# Altium project SKC_KONTROLER.PrjPcb (part 1 of 2)
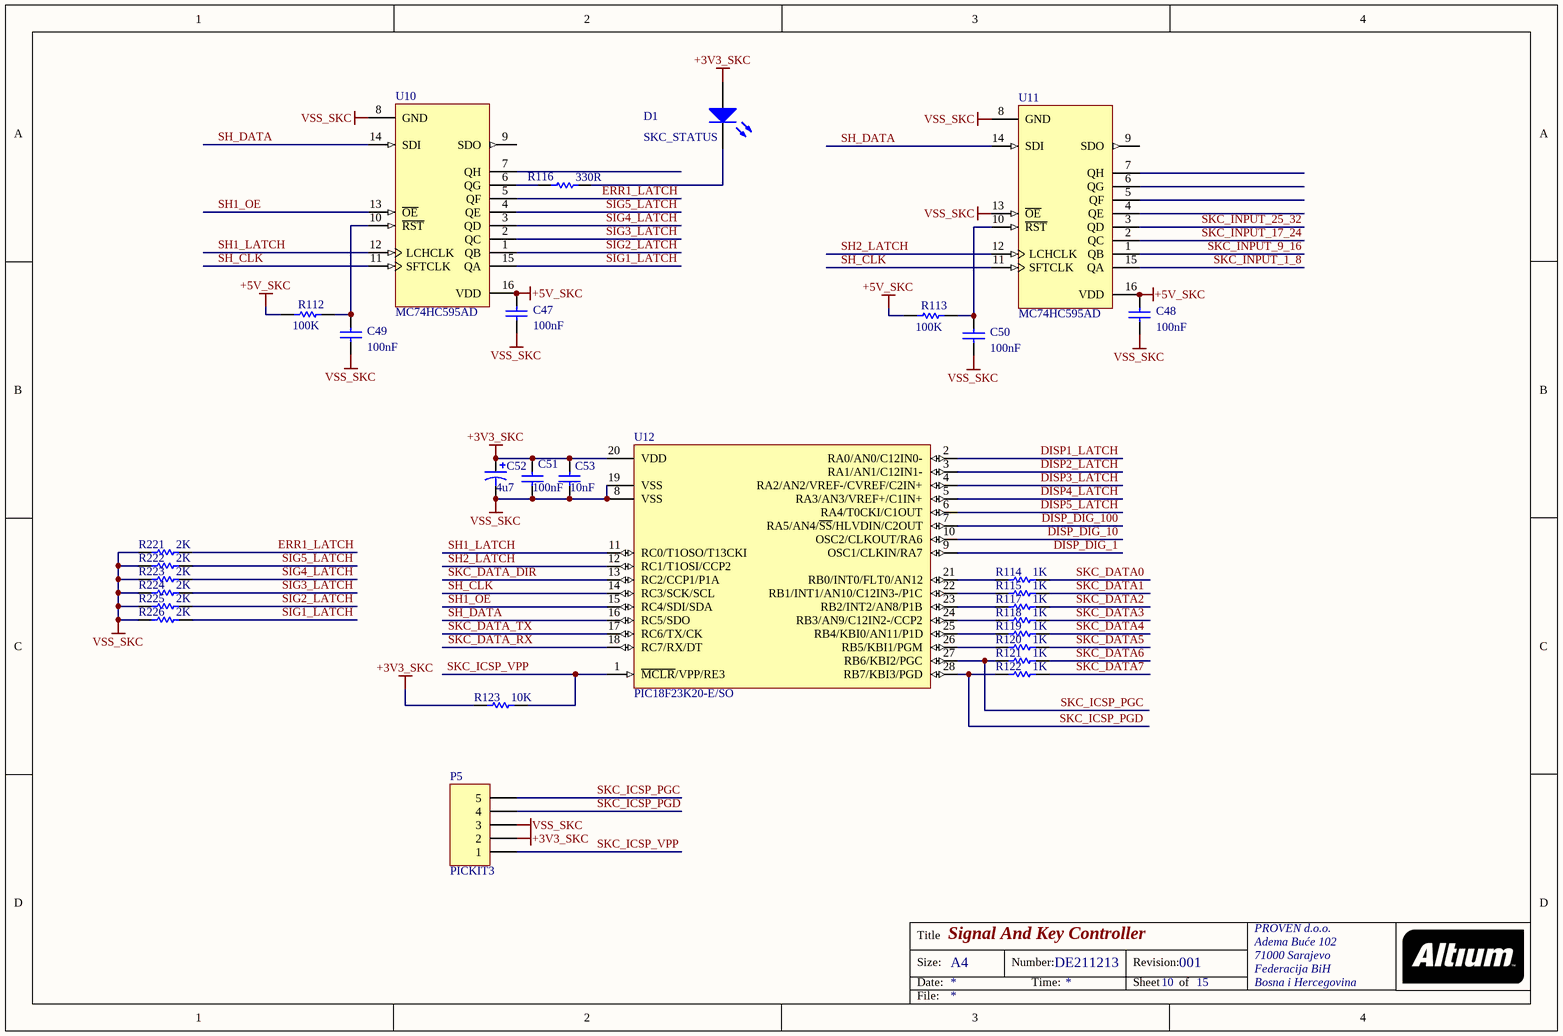
[diagram p0: SignalAndKeyController.SchDoc]
7 sheets, 399 parts. Net scope: global (net labels, ports and power ports of the same name join across sheets).
Board file: SKC_PCB.PcbDoc
Sheets:
  SignalAndKeyController.SchDoc
  SignalOutput.SchDoc
  SKC_DataComm.SchDoc
  SKC_Display.SchDoc
  SKC_ErrrorDisplay.SchDoc
  KeyInput.SchDoc
  SKC_PSU.SchDoc

## Sheet SignalAndKeyController.SchDoc: Signal And Key Controller
size A4; Author: eldar6776@hotmail.com; DrawnBy: Eldar Dedić; Organization: PROVEN d.o.o.; Address1: Adema Buće 102; Address2: 71000 Sarajevo; Address3: Federacija BiH; Address4: Bosna i Hercegovina; DocumentNumber: DE211213; Revision: 001; SheetNumber: 10; SheetTotal: 15; ProjectName: MIKSER SIROVINE

### Parts
C47  value 100nF  [1206]
C48  value 100nF  [1206]
C49  value 100nF  [1206]
C50  value 100nF  [1206]
C51  value 100nF  [1206]
C52  4u7  [C]
C53  value 10nF  [0805]
D1  SKC_STATUS  [2.0X1.25X0.8]
P5  PICKIT3  [HDR1X5]
R112  100K  [ERA-0603]
R113  100K  [ERA-0603]
R114  1K  [ERA-0603]
R115  1K  [ERA-0603]
R116  330R  [ERA-0603]
R117  1K  [ERA-0603]
R118  1K  [ERA-0603]
R119  1K  [ERA-0603]
R120  1K  [ERA-0603]
R121  1K  [ERA-0603]
R122  1K  [ERA-0603]
R123  10K  [ERA-0603]
R221  2K  [ERA-0603]
R222  2K  [ERA-0603]
R223  2K  [ERA-0603]
R224  2K  [ERA-0603]
R225  2K  [ERA-0603]
R226  2K  [ERA-0603]
U10  MC74HC595AD  [751B-05_N]
U11  MC74HC595AD  [751B-05_N]
U12  PIC18F23K20-E/SO  [SOIC-SO28_N]

### Nets
+3V3_SKC: C51.2 C52.1 C53.2 D1.1(A) P5.2 R123.1 U12.20(VDD)
+5V_SKC: C47.2 C48.2 R112.1 R113.1 U10.16(VDD) U11.16(VDD)
VSS_SKC: C47.1 C48.1 C49.1 C50.1 C51.1 C52.2 C53.1 P5.3 R221.2 R222.2 R223.2 R224.2 R225.2 R226.2 U10.8(GND) U11.8(GND) U11.13(~{OE}) U12.8(VSS) U12.19(VSS)
DISP1_LATCH: U12.2(RA0/AN0/C12IN0-)
DISP2_LATCH: U12.3(RA1/AN1/C12IN1-)
DISP3_LATCH: U12.4(RA2/AN2/VREF-/CVREF/C2IN+)
DISP4_LATCH: U12.5(RA3/AN3/VREF+/C1IN+)
DISP5_LATCH: U12.6(RA4/T0CKI/C1OUT)
DISP_DIG_1: U12.9(OSC1/CLKIN/RA7)
DISP_DIG_10: U12.10(OSC2/CLKOUT/RA6)
DISP_DIG_100: U12.7(RA5/AN4/~{SS}/HLVDIN/C2OUT)
ERR1_LATCH: R221.1 U10.5(QF)
SH1_LATCH: U10.12(LCHCLK) U12.11(RC0/T1OSO/T13CKI)
SH1_OE: U10.13(~{OE}) U12.15(RC4/SDI/SDA)
SH2_LATCH: U11.12(LCHCLK) U12.12(RC1/T1OSI/CCP2)
SH_CLK: U10.11(SFTCLK) U11.11(SFTCLK) U12.14(RC3/SCK/SCL)
SH_DATA: U10.14(SDI) U11.14(SDI) U12.16(RC5/SDO)
SIG1_LATCH: R226.1 U10.15(QA)
SIG2_LATCH: R225.1 U10.1(QB)
SIG3_LATCH: R224.1 U10.2(QC)
SIG4_LATCH: R223.1 U10.3(QD)
SIG5_LATCH: R222.1 U10.4(QE)
SKC_DATA0: R114.2
SKC_DATA1: R115.2
SKC_DATA2: R117.2
SKC_DATA3: R118.2
SKC_DATA4: R119.2
SKC_DATA5: R120.2
SKC_DATA6: R121.2
SKC_DATA7: R122.2
SKC_DATA_DIR: U12.13(RC2/CCP1/P1A)
SKC_DATA_RX: U12.18(RC7/RX/DT)
SKC_DATA_TX: U12.17(RC6/TX/CK)
SKC_ICSP_PGC: P5.5 R121.1 U12.27(RB6/KBI2/PGC)
SKC_ICSP_PGD: P5.4 R122.1 U12.28(RB7/KBI3/PGD)
SKC_ICSP_VPP: P5.1 R123.2 U12.1(~{MCLR}/VPP/RE3)
SKC_INPUT_1_8: U11.15(QA)
SKC_INPUT_9_16: U11.1(QB)
SKC_INPUT_17_24: U11.2(QC)
SKC_INPUT_25_32: U11.3(QD)
NetC49_2: C49.2 R112.2 U10.10(~{RST})
NetC50_2: C50.2 R113.2 U11.10(~{RST})
NetD1_2: D1.2(K) R116.2
NetR114_1: R114.1 U12.21(RB0/INT0/FLT0/AN12)
NetR115_1: R115.1 U12.22(RB1/INT1/AN10/C12IN3-/P1C)
NetR116_1: R116.1 U10.6(QG)
NetR117_1: R117.1 U12.23(RB2/INT2/AN8/P1B)
NetR118_1: R118.1 U12.24(RB3/AN9/C12IN2-/CCP2)
NetR119_1: R119.1 U12.25(RB4/KBI0/AN11/P1D)
NetR120_1: R120.1 U12.26(RB5/KBI1/PGM)

Not connected (* = marked no-connect by the designer): U10 7(QH) 9(SDO); U11 4(QE) 5(QF) 6(QG) 7(QH) 9(SDO)

### Notes on the sheet
- Title
- Size:
- Date:
- A4
- Number:
- Time:
- Revision:
- Sheet
- of
- File:

### Library data of the parts
C47-C51 = C1206: Ceramic Chip Capacitor - Standard; Published: 17-Jul-2002; LatestRevisionDate: 19-Mar-2004; LatestRevisionNote: Silkscreen size reduced.; DatasheetDocument: Mar-2001; PackageDocument: Mar-2001; PackageReference: 1206; Publisher: Altium Limited; Code_JEITA: 1206; Code_IPC: 3216 [1206]; ComponentLink1Description: Manufacturer Link; ComponentLink1URL: http://www.kemet.com/; ComponentLink2Description: Datasheet; ComponentLink2URL: http://www.kemet.com/kemet/web/homepage/kechome.nsf/vapubfilesname/F3102TA.pdf/$file/F3102TA.pdf
C52 = 94SC475X0025CBP: Solid Aluminum Capacitor with Organic Semiconductor Electrolyte: 4.7uF, 25V, Bulk Pack; Note: Part Numbers shown are for ± 20% capacitance tolerance (X0).; PCB_Layout: Complies with Manufacturer's Recommendation.; DrillSize: Nominal, Rounded to the nearest 0.1mm; Published: 19-Mar-2004; DatasheetDocument: 23-May-2001; PackageReference: C; Publisher: Altium Limited; ComponentLink1Description: Manufacturer Link; ComponentLink1URL: http://www.vishay.com/; ComponentLink2Description: Datasheet; ComponentLink2URL: http://www.vishay.com/docs/90004/94sc.pdf; Value: 4.7uF
C53 = C0805: Ceramic Chip Capacitor - Standard; Note: Footprint corresponds to dimensions for bulk cassette packaging. This case size has tightened tolerances.; Published: 17-Jul-2002; LatestRevisionDate: 19-Mar-2004; LatestRevisionNote: Silkscreen size reduced.; DatasheetDocument: Mar-2001; PackageDocument: Mar-2001; PackageReference: 0805; Publisher: Altium Limited; Code_JEITA: 0805; Code_IPC: 2012[0805]; ComponentLink1Description: Manufacturer Link; ComponentLink1URL: http://www.kemet.com/; ComponentLink2Description: Datasheet; ComponentLink2URL: http://www.kemet.com/kemet/web/homepage/kechome.nsf/vapubfilesname/F3102TA.pdf/$file/F3102TA.pdf
D1 = HSMA-S670: SMT Top Mount Chip LED, Amber; LuminousIntensity: 16mcd (Minimum).; PCB_Layout: Complies with manufacturer's recommendation.; Published: 11-Dec-2002; DatasheetVersion: 29-Oct-2001; PackageVersion: Oct-2001; PackageReference: 2.0X1.25X0.8; Publisher: Altium Limited; PackageDescription: SM LED; 2 Flat Leads; LED_Colour: Amber; ComponentLink1Description: Manufacturer Link; ComponentLink1URL: http://www.avagotech.com/; ComponentLink2Description: Datasheet; ComponentLink2URL: http://cp.literature.agilent.com/litweb/pdf/5988-4445EN.pdf
P5 = Header 5: Header, 5-Pin; LatestRevisionDate: 17-Jul-2002; LatestRevisionNote: Re-released for DXP Platform.; Publisher: Altium Limited
R112-R123 R221-R226 = ERA3Y: Rectangular Thick Film Chip Resistor, 10 Ohm to 330k Ohm Range, 0.1% and 0.5% Tolerance, 0603 Size, 0.063 W; Note: If flow soldering, adjust pad width of PCB Footprint to 0.7 - 0.8 times the width of the resistor.; Published: 17-Dec-2003; LatestRevisionDate: 19-Mar-2004; LatestRevisionNote: Silkscreen size reduced.; PackageDocument: Mar-2003; PackageReference: ERA-0603; Publisher: Altium Limited; Code_IPC: 1608 [0603]; ComponentLink1Description: Manufacturer Link; ComponentLink1URL: http://www.panasonic.com/industrial/components/resistive_products.htm; ComponentLink2Description: Datasheet; ComponentLink2URL: http://www.panasonic.com/industrial/components/pdf/AOA0000CE8.pdf
U10 U11 = MC74HC595AD: 8-Bit Serial-Input/Serial or Prallel-Output Shift Register with Latched 3-State Outputs; Published: 15-Apr-2002; LatestRevisionDate: 13-Apr-2006; LatestRevisionNote: IPC-7351 Footprint Added.; DatasheetVersion: Mar-2000; PackageVersion: Oct-1999; PackageReference: 751B-05; Publisher: Altium Limited; PackageDescription: 16-Pin Small Outline Integrated Circuit 1.27 mm Pitch; Code_JEDEC: MS-012-AC; Code_IPC: SOIC127P600-16; ComponentLink1Description: Manufacturer Link; ComponentLink1URL: http://www.onsemi.com/; ComponentLink2Description: Datasheet; ComponentLink2URL: http://www.onsemi.com/pub/Collateral/MC74HC595A-D.PDF
U12 = PIC18F23K20-E/SO: Flash Microcontroller with nanoWatt XLP Technology, 28-pin SOIC, Extended Temperature; Published: 2-Dec-2009; DatasheetVersion: revF, Sep-2009; PackageVersion: revBB, Aug-2009; PackageReference: SOIC-SO28; Publisher: Altium Limited; PackageDescription: 28-Lead Plastic Small Outline (SO) - Wide 7.50mm Body [SOIC]; Supplier 1: Digi-Key; Supplier Part Number 1: PIC18F23K20-E/SO-ND; Code_JEDEC: MS-013; ComponentLink1Description: Datasheet; ComponentLink1URL: http://ww1.microchip.com/downloads/en/DeviceDoc/41303F.pdf; ComponentLink2Description: Packaging Specification; ComponentLink2URL: http://www.microchip.com/stellent/groups/techpub_sg/documents/packagingspec/en012702.pdf; ComponentLink3Description: Microchip.com Home; ComponentLink3URL: http://www.microchip.com/

## Sheet SignalOutput.SchDoc: Signal output
size A3; Author: eldar6776@hotmail.com; DrawnBy: Eldar Dedić; Organization: PROVEN d.o.o.; Address1: Adema Buće 102; Address2: 71000 Sarajevo; Address3: Federacija BiH; Address4: Bosna i Hercegovina; DocumentNumber: DE211213; Revision: 001; SheetNumber: 11; SheetTotal: 15; ProjectName: MIKSER SIROVINE
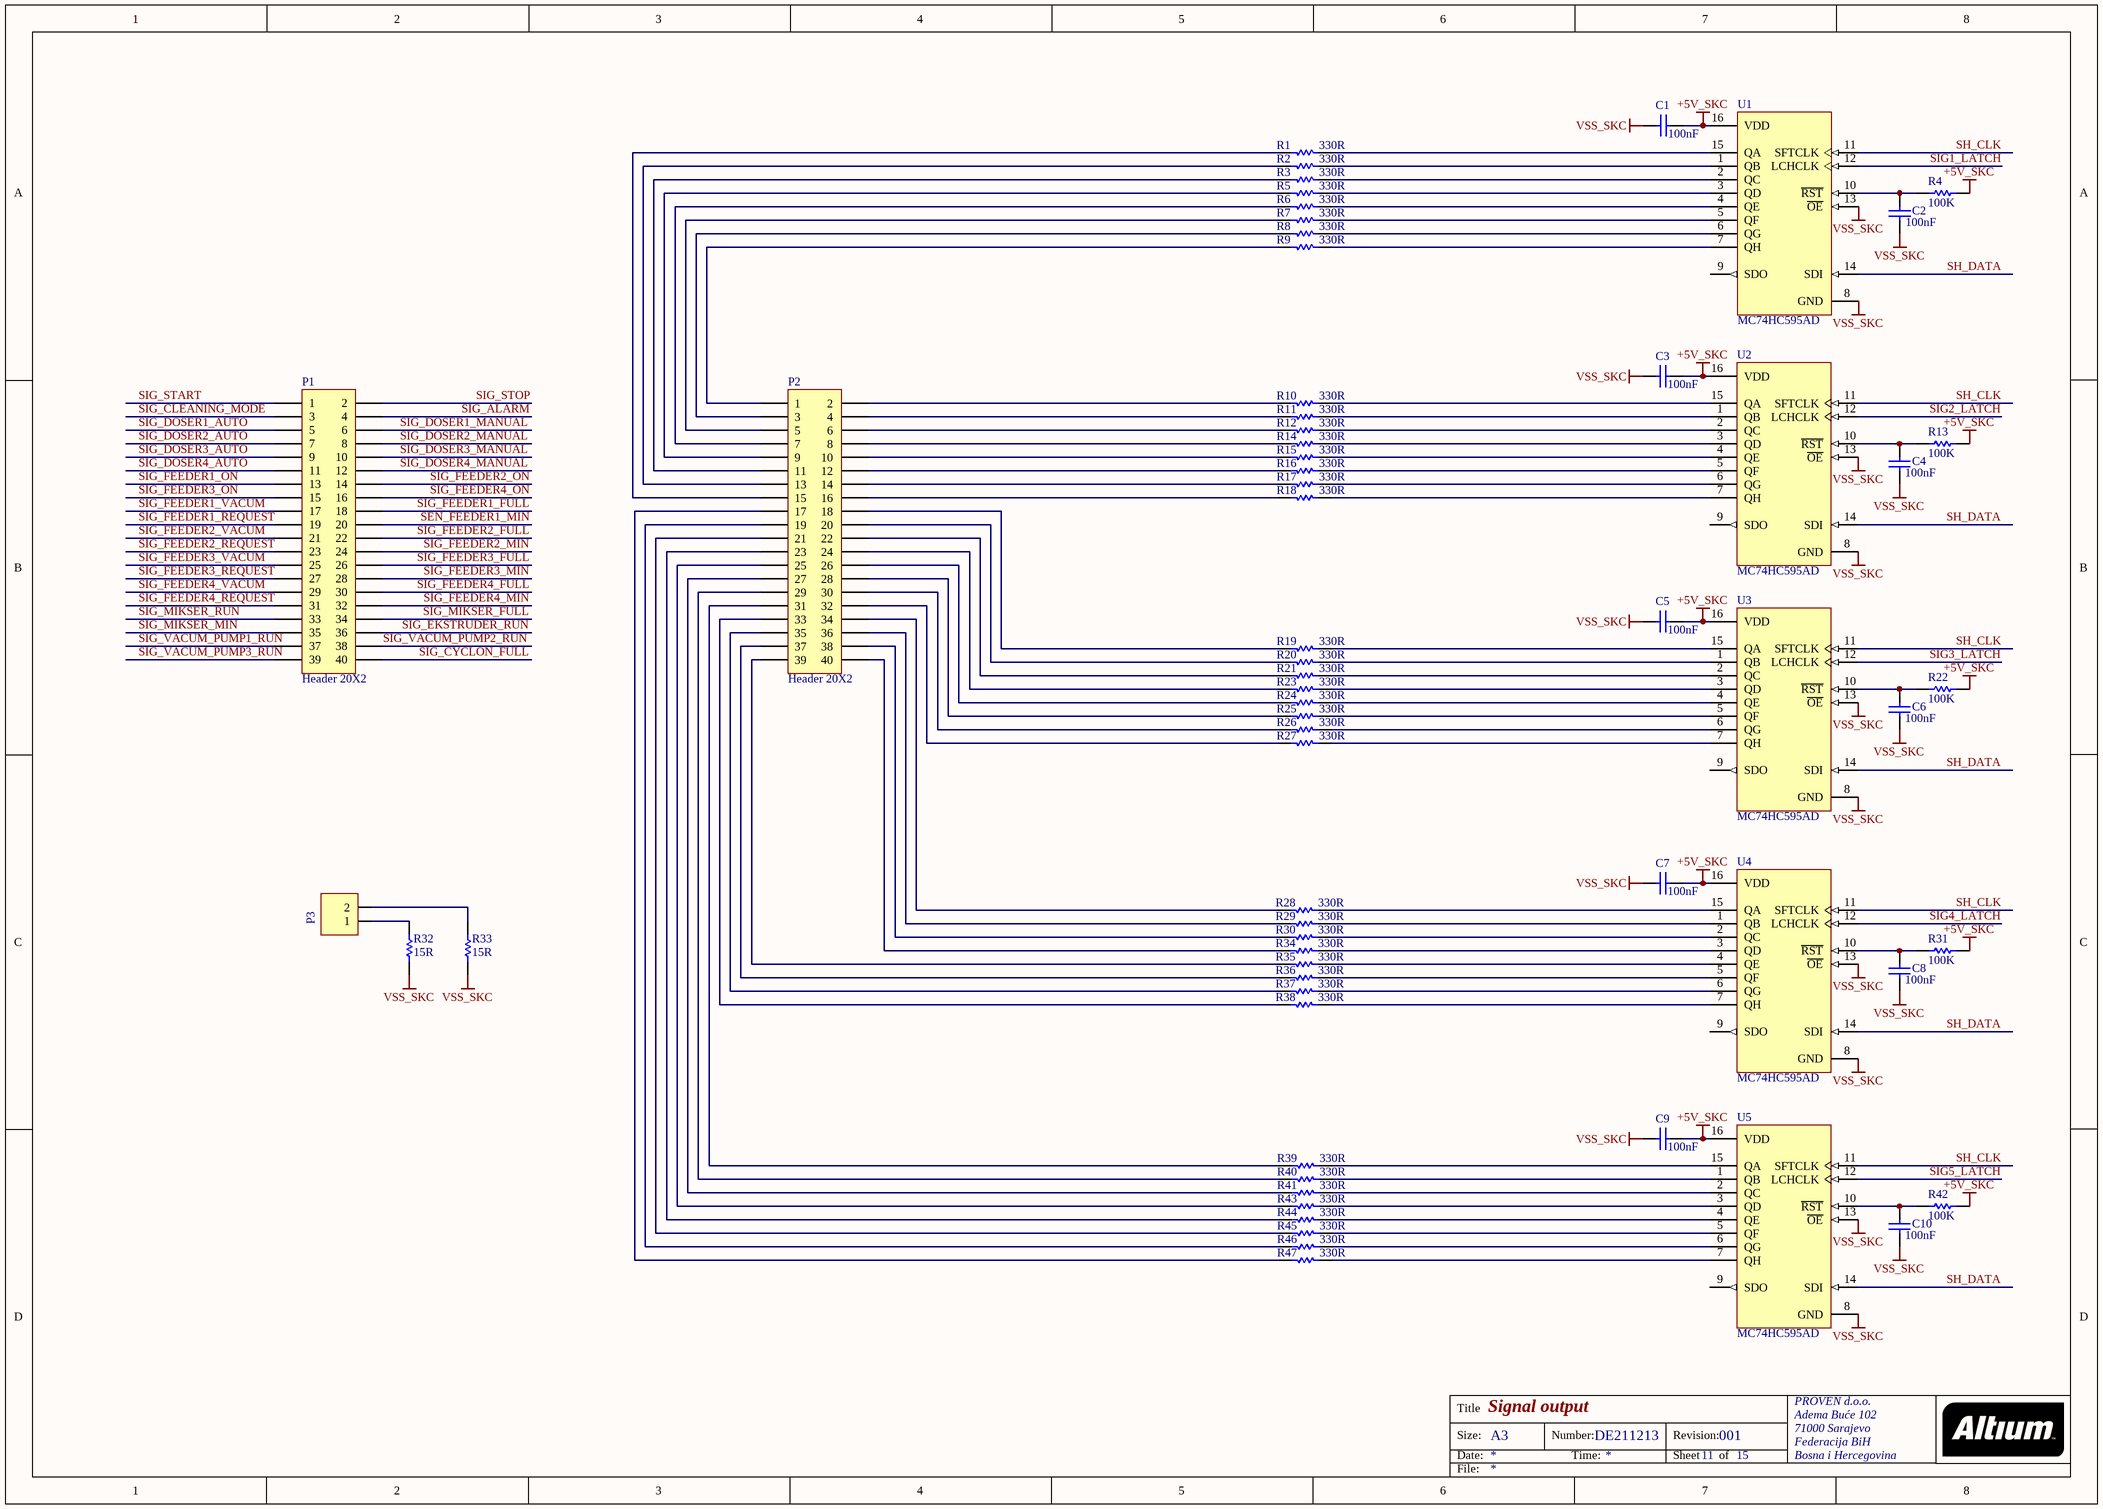
[diagram p1: SignalOutput.SchDoc]

### Parts
C1  value 100nF  [1206]
C2  value 100nF  [1206]
C3  value 100nF  [1206]
C4  value 100nF  [1206]
C5  value 100nF  [1206]
C6  value 100nF  [1206]
C7  value 100nF  [1206]
C8  value 100nF  [1206]
C9  value 100nF  [1206]
C10  value 100nF  [1206]
P1  Header 20X2  [HDR2X20]
P2  Header 20X2  [HDR2X20]
P3  (no value)  [TERMINAL BLOK 2]
R1  330R  [ERA-0805]
R2  330R  [ERA-0805]
R3  330R  [ERA-0805]
R4  100K  [ERA-0603]
R5  330R  [ERA-0805]
R6  330R  [ERA-0805]
R7  330R  [ERA-0805]
R8  330R  [ERA-0805]
R9  330R  [ERA-0805]
R10  330R  [ERA-0805]
R11  330R  [ERA-0805]
R12  330R  [ERA-0805]
R13  100K  [ERA-0603]
R14  330R  [ERA-0805]
R15  330R  [ERA-0805]
R16  330R  [ERA-0805]
R17  330R  [ERA-0805]
R18  330R  [ERA-0805]
R19  330R  [ERA-0805]
R20  330R  [ERA-0805]
R21  330R  [ERA-0805]
R22  100K  [ERA-0603]
R23  330R  [ERA-0805]
R24  330R  [ERA-0805]
R25  330R  [ERA-0805]
R26  330R  [ERA-0805]
R27  330R  [ERA-0805]
R28  330R  [ERA-0805]
R29  330R  [ERA-0805]
R30  330R  [ERA-0805]
R31  100K  [ERA-0603]
R32  15R  [RD6.35x2.3]
R33  15R  [RD6.35x2.3]
R34  330R  [ERA-0805]
R35  330R  [ERA-0805]
R36  330R  [ERA-0805]
R37  330R  [ERA-0805]
R38  330R  [ERA-0805]
R39  330R  [ERA-0805]
R40  330R  [ERA-0805]
R41  330R  [ERA-0805]
R42  100K  [ERA-0603]
R43  330R  [ERA-0805]
R44  330R  [ERA-0805]
R45  330R  [ERA-0805]
R46  330R  [ERA-0805]
R47  330R  [ERA-0805]
U1  MC74HC595AD  [751B-05_N]
U2  MC74HC595AD  [751B-05_N]
U3  MC74HC595AD  [751B-05_N]
U4  MC74HC595AD  [751B-05_N]
U5  MC74HC595AD  [751B-05_N]

### Nets
+5V_SKC: C1.1 C3.1 C5.1 C7.1 C9.1 R4.2 R13.2 R22.2 R31.2 R42.2 U1.16(VDD) U2.16(VDD) U3.16(VDD) U4.16(VDD) U5.16(VDD)
VSS_SKC: C1.2 C2.1 C3.2 C4.1 C5.2 C6.1 C7.2 C8.1 C9.2 C10.1 R32.1 R33.2 U1.8(GND) U1.13(~{OE}) U2.8(GND) U2.13(~{OE}) U3.8(GND) U3.13(~{OE}) U4.8(GND) U4.13(~{OE}) U5.8(GND) U5.13(~{OE})
SEN_FEEDER1_MIN: P1.20
SH_CLK: U1.11(SFTCLK) U2.11(SFTCLK) U3.11(SFTCLK) U4.11(SFTCLK) U5.11(SFTCLK)
SH_DATA: U1.14(SDI) U2.14(SDI) U3.14(SDI) U4.14(SDI) U5.14(SDI)
SIG1_LATCH: U1.12(LCHCLK)
SIG2_LATCH: U2.12(LCHCLK)
SIG3_LATCH: U3.12(LCHCLK)
SIG4_LATCH: U4.12(LCHCLK)
SIG5_LATCH: U5.12(LCHCLK)
SIG_ALARM: P1.4
SIG_CLEANING_MODE: P1.3
SIG_CYCLON_FULL: P1.40
SIG_DOSER1_AUTO: P1.5
SIG_DOSER1_MANUAL: P1.6
SIG_DOSER2_AUTO: P1.7
SIG_DOSER2_MANUAL: P1.8
SIG_DOSER3_AUTO: P1.9
SIG_DOSER3_MANUAL: P1.10
SIG_DOSER4_AUTO: P1.11
SIG_DOSER4_MANUAL: P1.12
SIG_EKSTRUDER_RUN: P1.36
SIG_FEEDER1_FULL: P1.18
SIG_FEEDER1_ON: P1.13
SIG_FEEDER1_REQUEST: P1.19
SIG_FEEDER1_VACUM: P1.17
SIG_FEEDER2_FULL: P1.22
SIG_FEEDER2_MIN: P1.24
SIG_FEEDER2_ON: P1.14
SIG_FEEDER2_REQUEST: P1.23
SIG_FEEDER2_VACUM: P1.21
SIG_FEEDER3_FULL: P1.26
SIG_FEEDER3_MIN: P1.28
SIG_FEEDER3_ON: P1.15
SIG_FEEDER3_REQUEST: P1.27
SIG_FEEDER3_VACUM: P1.25
SIG_FEEDER4_FULL: P1.30
SIG_FEEDER4_MIN: P1.32
SIG_FEEDER4_ON: P1.16
SIG_FEEDER4_REQUEST: P1.31
SIG_FEEDER4_VACUM: P1.29
SIG_MIKSER_FULL: P1.34
SIG_MIKSER_MIN: P1.35
SIG_MIKSER_RUN: P1.33
SIG_START: P1.1
SIG_STOP: P1.2
SIG_VACUM_PUMP1_RUN: P1.37
SIG_VACUM_PUMP2_RUN: P1.38
SIG_VACUM_PUMP3_RUN: P1.39
NetC2_2: C2.2 R4.1 U1.10(~{RST})
NetC4_2: C4.2 R13.1 U2.10(~{RST})
NetC6_2: C6.2 R22.1 U3.10(~{RST})
NetC8_2: C8.2 R31.1 U4.10(~{RST})
NetC10_2: C10.2 R42.1 U5.10(~{RST})
NetP2_1: P2.1 R9.1
NetP2_2: P2.2 R10.1
NetP2_3: P2.3 R8.1
NetP2_4: P2.4 R11.1
NetP2_5: P2.5 R7.1
NetP2_6: P2.6 R12.1
NetP2_7: P2.7 R6.1
NetP2_8: P2.8 R14.1
NetP2_9: P2.9 R5.1
NetP2_10: P2.10 R15.1
NetP2_11: P2.11 R3.1
NetP2_12: P2.12 R16.1
NetP2_13: P2.13 R2.1
NetP2_14: P2.14 R17.1
NetP2_15: P2.15 R1.1
NetP2_16: P2.16 R18.1
NetP2_17: P2.17 R47.1
NetP2_18: P2.18 R19.1
NetP2_19: P2.19 R46.1
NetP2_20: P2.20 R20.1
NetP2_21: P2.21 R45.1
NetP2_22: P2.22 R21.1
NetP2_23: P2.23 R44.1
NetP2_24: P2.24 R23.1
NetP2_25: P2.25 R43.1
NetP2_26: P2.26 R24.1
NetP2_27: P2.27 R41.1
NetP2_28: P2.28 R25.1
NetP2_29: P2.29 R40.1
NetP2_30: P2.30 R26.1
NetP2_31: P2.31 R39.1
NetP2_32: P2.32 R27.1
NetP2_33: P2.33 R38.1
NetP2_34: P2.34 R28.1
NetP2_35: P2.35 R37.1
NetP2_36: P2.36 R29.1
NetP2_37: P2.37 R36.1
NetP2_38: P2.38 R30.1
NetP2_39: P2.39 R35.1
NetP2_40: P2.40 R34.1
NetP3_1: P3.1 R32.2
NetP3_2: P3.2 R33.1
NetR1_2: R1.2 U1.15(QA)
NetR2_2: R2.2 U1.1(QB)
NetR3_2: R3.2 U1.2(QC)
NetR5_2: R5.2 U1.3(QD)
NetR6_2: R6.2 U1.4(QE)
NetR7_2: R7.2 U1.5(QF)
NetR8_2: R8.2 U1.6(QG)
NetR9_2: R9.2 U1.7(QH)
NetR10_2: R10.2 U2.15(QA)
NetR11_2: R11.2 U2.1(QB)
NetR12_2: R12.2 U2.2(QC)
NetR14_2: R14.2 U2.3(QD)
NetR15_2: R15.2 U2.4(QE)
NetR16_2: R16.2 U2.5(QF)
NetR17_2: R17.2 U2.6(QG)
NetR18_2: R18.2 U2.7(QH)
NetR19_2: R19.2 U3.15(QA)
NetR20_2: R20.2 U3.1(QB)
NetR21_2: R21.2 U3.2(QC)
NetR23_2: R23.2 U3.3(QD)
NetR24_2: R24.2 U3.4(QE)
NetR25_2: R25.2 U3.5(QF)
NetR26_2: R26.2 U3.6(QG)
NetR27_2: R27.2 U3.7(QH)
NetR28_2: R28.2 U4.15(QA)
NetR29_2: R29.2 U4.1(QB)
NetR30_2: R30.2 U4.2(QC)
NetR34_2: R34.2 U4.3(QD)
NetR35_2: R35.2 U4.4(QE)
NetR36_2: R36.2 U4.5(QF)
NetR37_2: R37.2 U4.6(QG)
NetR38_2: R38.2 U4.7(QH)
NetR39_2: R39.2 U5.15(QA)
NetR40_2: R40.2 U5.1(QB)
NetR41_2: R41.2 U5.2(QC)
NetR43_2: R43.2 U5.3(QD)
NetR44_2: R44.2 U5.4(QE)
NetR45_2: R45.2 U5.5(QF)
NetR46_2: R46.2 U5.6(QG)
NetR47_2: R47.2 U5.7(QH)

Not connected (* = marked no-connect by the designer): U1 9(SDO); U2 9(SDO); U3 9(SDO); U4 9(SDO); U5 9(SDO)

### Notes on the sheet
- Title
- Size:
- Date:
- A3
- Number:
- Time:
- Revision:
- Sheet
- of
- File:

### Library data of the parts
C1-C10 = C1206: Ceramic Chip Capacitor - Standard; Published: 17-Jul-2002; LatestRevisionDate: 19-Mar-2004; LatestRevisionNote: Silkscreen size reduced.; DatasheetDocument: Mar-2001; PackageDocument: Mar-2001; PackageReference: 1206; Publisher: Altium Limited; Code_JEITA: 1206; Code_IPC: 3216 [1206]; ComponentLink1Description: Manufacturer Link; ComponentLink1URL: http://www.kemet.com/; ComponentLink2Description: Datasheet; ComponentLink2URL: http://www.kemet.com/kemet/web/homepage/kechome.nsf/vapubfilesname/F3102TA.pdf/$file/F3102TA.pdf
P1 P2 = Header 20X2: Header, 20-Pin, Dual row; LatestRevisionDate: 17-Jul-2002; LatestRevisionNote: Re-released for DXP Platform.; Publisher: Altium Limited
P3 = Terminal blok 2 pina: Terminal blok 2
R1-R3 R5-R12 R14-R21 R23-R30 R34-R41 R43-R47 = ERA6Y: Rectangular Thick Film Chip Resistor, 10 Ohm to 1M Ohm Range, 0.1% and 0.5% Tolerance, 0805 Size, 0.1 W; Note: If flow soldering, adjust pad width of PCB Footprint to 0.7 - 0.8 times the width of the resistor.; Published: 17-Dec-2003; LatestRevisionDate: 19-Mar-2004; LatestRevisionNote: Silkscreen size reduced.; PackageDocument: Mar-2003; PackageReference: ERA-0805; Publisher: Altium Limited; Code_IPC: 2012 [0805]; ComponentLink1Description: Manufacturer Link; ComponentLink1URL: http://www.panasonic.com/industrial/components/resistive_products.htm; ComponentLink2Description: Datasheet; ComponentLink2URL: http://www.panasonic.com/industrial/components/pdf/AOA0000CE8.pdf
R4 R13 R22 R31 R42 = ERA3Y: as R112 on sheet SignalAndKeyController; Published: 17-Dec-2003; LatestRevisionDate: 19-Mar-2004; LatestRevisionNote: Silkscreen size reduced.; PackageDocument: Mar-2003; PackageReference: ERA-0603; Publisher: Altium Limited; Code_IPC: 1608 [0603]; ComponentLink1Description: Manufacturer Link; ComponentLink1URL: http://www.panasonic.com/industrial/components/resistive_products.htm; ComponentLink2Description: Datasheet; ComponentLink2URL: http://www.panasonic.com/industrial/components/pdf/AOA0000CE8.pdf
R32 R33 = ERD25T: Carbon Film Resistor, 1 Ohm to 3.3M Ohm Range, 5% Tolerance, 0.25 W; Published: 17-Dec-2003; PackageReference: RD6.35x2.3; Publisher: Altium Limited; ComponentLink1Description: Manufacturer Link; ComponentLink1URL: http://www.panasonic.com/industrial/components/resistive_products.htm; ComponentLink2Description: Datasheet; ComponentLink2URL: http://www.panasonic.com/industrial/components/pdf/AOA0000CE12.pdf
U1-U5 = MC74HC595AD: as U10 on sheet SignalAndKeyController; Published: 15-Apr-2002; LatestRevisionDate: 13-Apr-2006; LatestRevisionNote: IPC-7351 Footprint Added.; DatasheetVersion: Mar-2000; PackageVersion: Oct-1999; PackageReference: 751B-05; Publisher: Altium Limited; PackageDescription: 16-Pin Small Outline Integrated Circuit 1.27 mm Pitch; Code_JEDEC: MS-012-AC; Code_IPC: SOIC127P600-16; ComponentLink1Description: Manufacturer Link; ComponentLink1URL: http://www.onsemi.com/; ComponentLink2Description: Datasheet; ComponentLink2URL: http://www.onsemi.com/pub/Collateral/MC74HC595A-D.PDF

## Sheet SKC_DataComm.SchDoc: SKC Data Comm
size A4; Author: eldar6776@hotmail.com; DrawnBy: Eldar Dedić; Organization: PROVEN d.o.o.; Address1: Adema Buće 102; Address2: 71000 Sarajevo; Address3: Federacija BiH; Address4: Bosna i Hercegovina; DocumentNumber: DE211213; Revision: 001; SheetNumber: 15; SheetTotal: 15; ProjectName: MIKSER SIROVINE
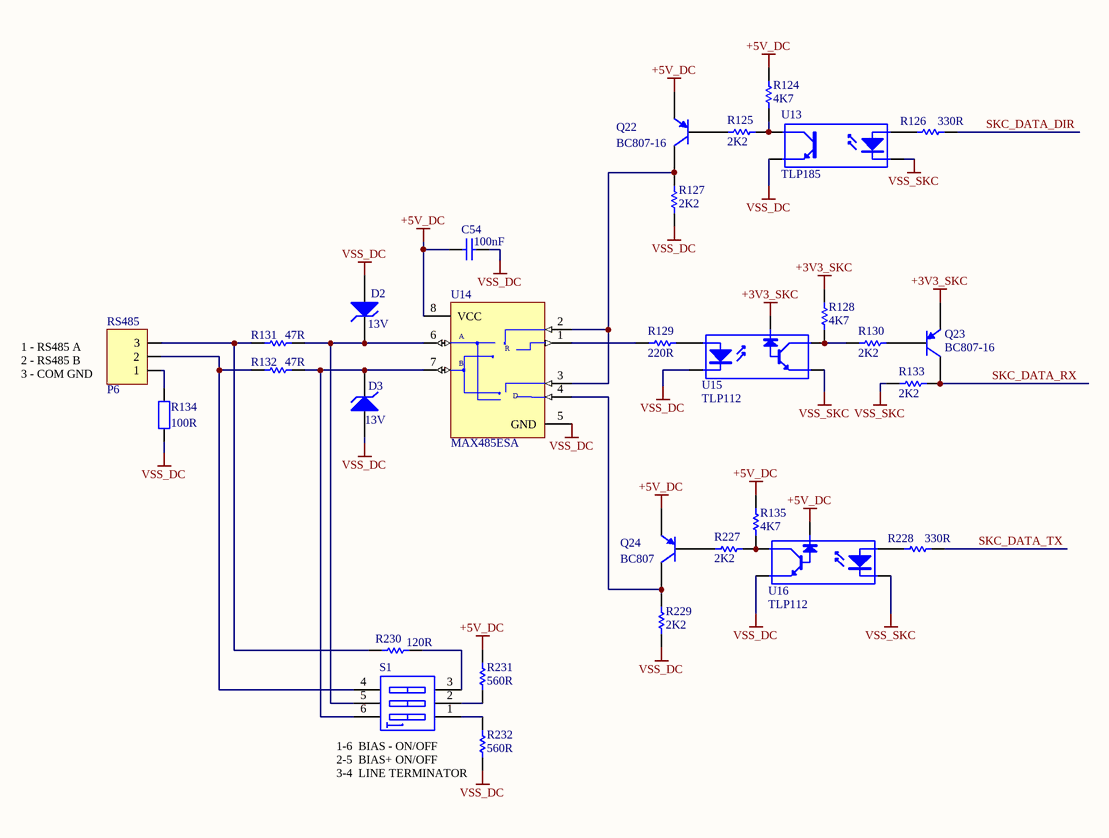
[diagram p2: SKC_DataComm.SchDoc]

### Parts
C54  100nF  [1206]
D2  13V  [DO-35A]
D3  13V  [DO-35A]
P6  RS485  [TERMINAL BLOK 3]
Q22  BC807-16  [SOT23_N]
Q23  BC807-16  [SOT23_N]
Q24  BC807  [SOT23_N]
R124  4K7  [ERA-0805]
R125  2K2  [ERA-0805]
R126  330R  [ERA-0805]
R127  2K2  [8-1206]
R128  4K7  [ERA-0805]
R129  220R  [ERA-0805]
R130  2K2  [ERA-0805]
R131  47R  [ERA-0805]
R132  47R  [ERA-0805]
R133  2K2  [8-1206]
R134  100R  [AXIAL-0.4]
R135  4K7  [ERA-0805]
R227  2K2  [8-1206]
R228  330R  [ERA-0805]
R229  2K2  [8-1206]
R230  120R  [ERA-0805]
R231  560R  [ERA-0805]
R232  560R  [ERA-0805]
S1  (no value)  [DIP-6]
U13  TLP185  [SOP4]
U14  MAX485ESA  [NSO8_N]
U15  TLP112  [SOP5]
U16  TLP112  [SOP5]

### Nets
+3V3_SKC: Q23.2(E) R128.1 U15.6(K)
+5V_DC: C54.2 Q22.2(E) Q24.2(E) R124.1 R135.1 R231.2 U14.8(VCC) U16.6(K)
VSS_DC: C54.1 D2.1(A) D3.1(A) R127.1 R134.1 R229.1 R232.1 U13.4(E) U14.5(GND) U15.3(K) U16.4(E)
VSS_SKC: R133.1 U13.3(K) U15.4(E) U16.3(K)
SKC_DATA_DIR: R126.2
SKC_DATA_RX: Q23.3(C) R133.2
SKC_DATA_TX: R228.2
NetD2_2: D2.2(K) R131.2 S1.5(B2) U14.6(A)
NetD3_2: D3.2(K) R132.2 S1.6(B1) U14.7(B)
NetP6_1: P6.1 R134.2
NetP6_2: P6.2 R132.1 S1.4(B3)
NetP6_3: P6.3 R131.1 R230.1
NetQ22_1: Q22.1(B) R125.2
NetQ22_3: Q22.3(C) R127.2 U14.2(~{RE}) U14.3(DE)
NetQ23_1: Q23.1(B) R130.1
NetQ24_1: Q24.1(B) R227.2
NetQ24_3: Q24.3(C) R229.2 U14.4(DI)
NetR124_2: R124.2 R125.1 U13.6(C)
NetR126_1: R126.1 U13.1(A)
NetR128_2: R128.2 R130.2 U15.5(C)
NetR129_1: R129.1 U15.1(A)
NetR129_2: R129.2 U14.1(RO)
NetR135_2: R135.2 R227.1 U16.5(C)
NetR228_1: R228.1 U16.1(A)
NetR230_2: R230.2 S1.3(A3)
NetR231_1: R231.1 S1.2(A2)
NetR232_2: R232.2 S1.1(A1)

### Notes on the sheet
- 1 - RS485 A
  2 - RS485 B
  3 - COM GND
- (near R232) 1-6  BIAS - ON/OFF
  2-5  BIAS+ ON/OFF
  3-4  LINE TERMINATOR
- Title
- Size:
- Date:
- A4
- Number:
- Time:
- Revision:
- Sheet
- of
- File:
- (in symbol MAX485ESA) R; D

### Library data of the parts
C54 = C1206: Ceramic Chip Capacitor - Standard; Published: 17-Jul-2002; LatestRevisionDate: 19-Mar-2004; LatestRevisionNote: Silkscreen size reduced.; DatasheetDocument: Mar-2001; PackageDocument: Mar-2001; PackageReference: 1206; Publisher: Altium Limited; Code_JEITA: 1206; Code_IPC: 3216 [1206]; ComponentLink1Description: Manufacturer Link; ComponentLink1URL: http://www.kemet.com/; ComponentLink2Description: Datasheet; ComponentLink2URL: http://www.kemet.com/kemet/web/homepage/kechome.nsf/vapubfilesname/F3102TA.pdf/$file/F3102TA.pdf
D2 D3 = D Zener: Zener Diode; Published: 8-Jun-2000; LatestRevisionDate: 17-Jul-2002; LatestRevisionNote: Re-released for DXP Platform.; PackageReference: DIODE-0.7; Publisher: Altium Limited; PackageDescription: Diode, Thru-Hole; 2 Leads; 0.7 in Pin Spacing
P6 = TERMINAL BLOK 3: 3 pinski terminal blok konektor
Q22-Q24 = BC807-16: PNP General-purpose Transistor; Published: 17-Sep-2003; LatestRevisionDate: 12-Dec-2006; LatestRevisionNote: IPC-7351 Footprint Added.; DatasheetVersion: 8-Apr-1999; PackageVersion: May-1999; PackageReference: SOT23; Publisher: Altium Limited; PackageDescription: 3-Pin SOT-23 Package 0.95 mm Pitch, 2.3 mm Lead Span; ComponentLink1Description: Manufacturer Link; ComponentLink1URL: http://www.semiconductors.philips.com/; ComponentLink2Description: Datasheet; ComponentLink2URL: http://www.semiconductors.philips.com/acrobat/datasheets/BC807_BC807W_BC327_5.pdf
R124 R125 R128-R132 R135 R230-R232 = ERAS: Metal Film Thermosensitive Chip Resistor, 0.56 Ohm to 10k Ohm Range, 5% Tolerance, 0805 Size, 0.1 W; Note: If flow soldering, adjust pad width of PCB Footprint to 0.7 - 0.8 times the width of the resistor.; Published: 17-Dec-2003; LatestRevisionDate: 19-Mar-2004; LatestRevisionNote: Silkscreen size reduced.; PackageDocument: Mar-2003; PackageReference: ERA-0805; Publisher: Altium Limited; Code_IPC: 2012 [0805]; ComponentLink1Description: Manufacturer Link; ComponentLink1URL: http://www.panasonic.com/industrial/components/resistive_products.htm; ComponentLink2Description: Datasheet; ComponentLink2URL: http://www.panasonic.com/industrial/components/pdf/AOF0000CE1.pdf
R126 R228 = ERA6Y: as R1 on sheet SignalOutput; Published: 17-Dec-2003; LatestRevisionDate: 19-Mar-2004; LatestRevisionNote: Silkscreen size reduced.; PackageDocument: Mar-2003; PackageReference: ERA-0805; Publisher: Altium Limited; Code_IPC: 2012 [0805]; ComponentLink1Description: Manufacturer Link; ComponentLink1URL: http://www.panasonic.com/industrial/components/resistive_products.htm; ComponentLink2Description: Datasheet; ComponentLink2URL: http://www.panasonic.com/industrial/components/pdf/AOA0000CE8.pdf
R127 R133 R227 R229 = ERJ8GE: Thick Film Chip Resistor, 1 Ohm to 10M Ohm Range, 5% Tolerance, 1206 Size, 0.25 W; Note: If flow soldering, adjust pad width of PCB Footprint to 0.7 - 0.8 times the width of the resistor.; Published: 17-Dec-2003; LatestRevisionDate: 19-Mar-2004; LatestRevisionNote: Silkscreen size reduced.; PackageDocument: Mar-2003; PackageReference: 8-1206; Publisher: Altium Limited; Code_IPC: 3216 [1206]; ComponentLink1Description: Manufacturer Link; ComponentLink1URL: http://www.panasonic.com/industrial/components/resistive_products.htm; ComponentLink2Description: Datasheet; ComponentLink2URL: http://www.panasonic.com/industrial/components/pdf/AOA0000CE1.pdf
R134 = Res2: Resistor; Published: 8-Jun-2000; LatestRevisionDate: 17-Jul-2002; LatestRevisionNote: Re-released for DXP Platform.; PackageReference: AXIAL-0.4; Publisher: Altium Limited; PackageDescription: Axial Device, Thru-Hole; 2 Leads; 0.4 in Pin Spacing
S1 = SW DIP-3: DIP Switch, 3 Position, SPST; Published: 24-Mar-1999; LatestRevisionDate: 17-Jul-2002; LatestRevisionNote: Re-released for DXP Platform.; PackageReference: DIP-6; Publisher: Altium Limited; Code_JEDEC: MO-001-AM
U13 = TLP185: 4 Pin Mini Flat Pack Optocoupler; Published: 24-Mar-1999; LatestRevisionDate: 04-Mar-2005; LatestRevisionNote: PCB Footprint replaced, Sch pins re-numbered.; DatasheetVersion: Apr-2004; PackageReference: SOP5(6); Publisher: Altium Limited; PackageDescription: Small Outline; 6 Leads (1 Absent); Body Width 4.4 mm; Pitch 1.27 mm
U14 = MAX485ESA: Low-Power, Slew-Rate-Limited RS-485/RS-422 Transceiver; Published: 16-Jan-2001; LatestRevisionDate: 13-Apr-2006; LatestRevisionNote: IPC-7351 Footprint Added.; DatasheetVersion: Feb-1996; PackageReference: NSO8; Publisher: Altium Limited; PackageDescription: 8-Pin Small Outline Integrated Circuit 1.27 mm Pitch; Code_JEDEC: MS-012-AA; Code_IPC: SOIC127P600-8; ComponentLink1Description: Manufacturer Link; ComponentLink1URL: http://www.maxim-ic.com/; ComponentLink2Description: Datasheet; ComponentLink2URL: http://pdfserv.maxim-ic.com/en/ds/MAX1487-MAX491.pdf
U15 U16 = TLP112: 5 Pin Mini Flat Pack Optocoupler; Published: 24-Mar-1999; LatestRevisionDate: 04-Mar-2005; LatestRevisionNote: PCB Footprint replaced, Sch pins re-numbered.; DatasheetVersion: Apr-2004; PackageReference: SOP5(6); Publisher: Altium Limited; PackageDescription: Small Outline; 6 Leads (1 Absent); Body Width 4.4 mm; Pitch 1.27 mm

## Sheet SKC_Display.SchDoc: SKC Display
size A3; Author: eldar6776@hotmail.com; DrawnBy: Eldar Dediæ; Organization: PROVEN d.o.o.; Address1: Adema Buæe 102; Address2: 71000 Sarajevo; Address3: Federacija BiH; Address4: Bosna i Hercegovina; DocumentNumber: DE211213; Revision: 001; SheetNumber: 13; SheetTotal: 15; ProjectName: MIKSER SIROVINE
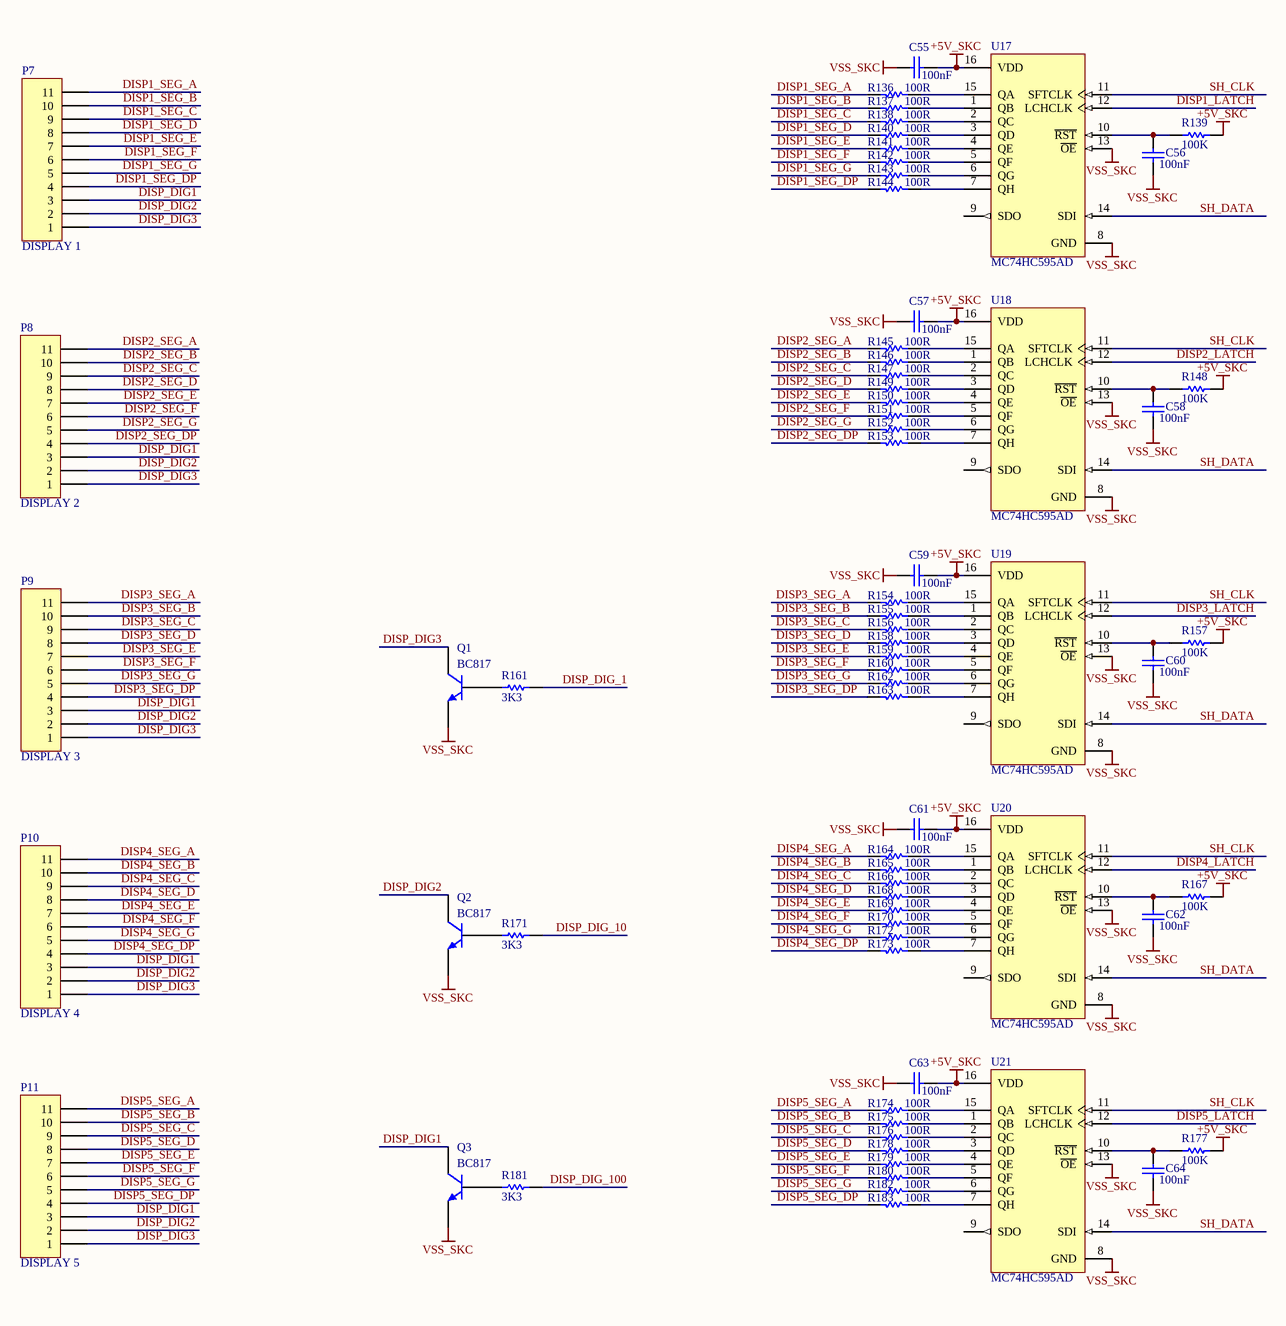
[diagram p3: SKC_Display.SchDoc]

### Parts
C55  value 100nF  [1206]
C56  value 100nF  [1206]
C57  value 100nF  [1206]
C58  value 100nF  [1206]
C59  value 100nF  [1206]
C60  value 100nF  [1206]
C61  value 100nF  [1206]
C62  value 100nF  [1206]
C63  value 100nF  [1206]
C64  value 100nF  [1206]
P7  DISPLAY 1  [HDR1X11]
P8  DISPLAY 2  [HDR1X11]
P9  DISPLAY 3  [HDR1X11]
P10  DISPLAY 4  [HDR1X11]
P11  DISPLAY 5  [HDR1X11]
Q1  BC817  [SOT23_N]
Q2  BC817  [SOT23_N]
Q3  BC817  [SOT23_N]
R136  100R  [ERA-0603]
R137  100R  [ERA-0603]
R138  100R  [ERA-0603]
R139  100K  [ERA-0603]
R140  100R  [ERA-0603]
R141  100R  [ERA-0603]
R142  100R  [ERA-0603]
R143  100R  [ERA-0603]
R144  100R  [ERA-0603]
R145  100R  [ERA-0603]
R146  100R  [ERA-0603]
R147  100R  [ERA-0603]
R148  100K  [ERA-0603]
R149  100R  [ERA-0603]
R150  100R  [ERA-0603]
R151  100R  [ERA-0603]
R152  100R  [ERA-0603]
R153  100R  [ERA-0603]
R154  100R  [ERA-0603]
R155  100R  [ERA-0603]
R156  100R  [ERA-0603]
R157  100K  [ERA-0603]
R158  100R  [ERA-0603]
R159  100R  [ERA-0603]
R160  100R  [ERA-0603]
R161  3K3  [ERA-0603]
R162  100R  [ERA-0603]
R163  100R  [ERA-0603]
R164  100R  [ERA-0603]
R165  100R  [ERA-0603]
R166  100R  [ERA-0603]
R167  100K  [ERA-0603]
R168  100R  [ERA-0603]
R169  100R  [ERA-0603]
R170  100R  [ERA-0603]
R171  3K3  [ERA-0603]
R172  100R  [ERA-0603]
R173  100R  [ERA-0603]
R174  100R  [ERA-0603]
R175  100R  [ERA-0603]
R176  100R  [ERA-0603]
R177  100K  [ERA-0603]
R178  100R  [ERA-0603]
R179  100R  [ERA-0603]
R180  100R  [ERA-0603]
R181  3K3  [ERA-0603]
R182  100R  [ERA-0603]
R183  100R  [ERA-0603]
U17  MC74HC595AD  [751B-05_N]
U18  MC74HC595AD  [751B-05_N]
U19  MC74HC595AD  [751B-05_N]
U20  MC74HC595AD  [751B-05_N]
U21  MC74HC595AD  [751B-05_N]

### Nets
+5V_SKC: C55.1 C57.1 C59.1 C61.1 C63.1 R139.2 R148.2 R157.2 R167.2 R177.2 U17.16(VDD) U18.16(VDD) U19.16(VDD) U20.16(VDD) U21.16(VDD)
VSS_SKC: C55.2 C56.1 C57.2 C58.1 C59.2 C60.1 C61.2 C62.1 C63.2 C64.1 Q1.2(E) Q2.2(E) Q3.2(E) U17.8(GND) U17.13(~{OE}) U18.8(GND) U18.13(~{OE}) U19.8(GND) U19.13(~{OE}) U20.8(GND) U20.13(~{OE}) U21.8(GND) U21.13(~{OE})
DISP1_LATCH: U17.12(LCHCLK)
DISP1_SEG_A: P7.11 R136.2
DISP1_SEG_B: P7.10 R137.2
DISP1_SEG_C: P7.9 R138.2
DISP1_SEG_D: P7.8 R140.2
DISP1_SEG_DP: P7.4 R144.2
DISP1_SEG_E: P7.7 R141.2
DISP1_SEG_F: P7.6 R142.2
DISP1_SEG_G: P7.5 R143.2
DISP2_LATCH: U18.12(LCHCLK)
DISP2_SEG_A: P8.11 R145.2
DISP2_SEG_B: P8.10 R146.2
DISP2_SEG_C: P8.9 R147.2
DISP2_SEG_D: P8.8 R149.2
DISP2_SEG_DP: P8.4 R153.2
DISP2_SEG_E: P8.7 R150.2
DISP2_SEG_F: P8.6 R151.2
DISP2_SEG_G: P8.5 R152.2
DISP3_LATCH: U19.12(LCHCLK)
DISP3_SEG_A: P9.11 R154.2
DISP3_SEG_B: P9.10 R155.2
DISP3_SEG_C: P9.9 R156.2
DISP3_SEG_D: P9.8 R158.2
DISP3_SEG_DP: P9.4 R163.2
DISP3_SEG_E: P9.7 R159.2
DISP3_SEG_F: P9.6 R160.2
DISP3_SEG_G: P9.5 R162.2
DISP4_LATCH: U20.12(LCHCLK)
DISP4_SEG_A: P10.11 R164.2
DISP4_SEG_B: P10.10 R165.2
DISP4_SEG_C: P10.9 R166.2
DISP4_SEG_D: P10.8 R168.2
DISP4_SEG_DP: P10.4 R173.2
DISP4_SEG_E: P10.7 R169.2
DISP4_SEG_F: P10.6 R170.2
DISP4_SEG_G: P10.5 R172.2
DISP5_LATCH: U21.12(LCHCLK)
DISP5_SEG_A: P11.11 R174.2
DISP5_SEG_B: P11.10 R175.2
DISP5_SEG_C: P11.9 R176.2
DISP5_SEG_D: P11.8 R178.2
DISP5_SEG_DP: P11.4 R183.2
DISP5_SEG_E: P11.7 R179.2
DISP5_SEG_F: P11.6 R180.2
DISP5_SEG_G: P11.5 R182.2
DISP_DIG1: P7.3 P8.3 P9.3 P10.3 P11.3 Q3.3(C)
DISP_DIG2: P7.2 P8.2 P9.2 P10.2 P11.2 Q2.3(C)
DISP_DIG3: P7.1 P8.1 P9.1 P10.1 P11.1 Q1.3(C)
DISP_DIG_1: R161.2
DISP_DIG_10: R171.2
DISP_DIG_100: R181.2
SH_CLK: U17.11(SFTCLK) U18.11(SFTCLK) U19.11(SFTCLK) U20.11(SFTCLK) U21.11(SFTCLK)
SH_DATA: U17.14(SDI) U18.14(SDI) U19.14(SDI) U20.14(SDI) U21.14(SDI)
NetC56_2: C56.2 R139.1 U17.10(~{RST})
NetC58_2: C58.2 R148.1 U18.10(~{RST})
NetC60_2: C60.2 R157.1 U19.10(~{RST})
NetC62_2: C62.2 R167.1 U20.10(~{RST})
NetC64_2: C64.2 R177.1 U21.10(~{RST})
NetQ1_1: Q1.1(B) R161.1
NetQ2_1: Q2.1(B) R171.1
NetQ3_1: Q3.1(B) R181.1
NetR136_1: R136.1 U17.15(QA)
NetR137_1: R137.1 U17.1(QB)
NetR138_1: R138.1 U17.2(QC)
NetR140_1: R140.1 U17.3(QD)
NetR141_1: R141.1 U17.4(QE)
NetR142_1: R142.1 U17.5(QF)
NetR143_1: R143.1 U17.6(QG)
NetR144_1: R144.1 U17.7(QH)
NetR145_1: R145.1 U18.15(QA)
NetR146_1: R146.1 U18.1(QB)
NetR147_1: R147.1 U18.2(QC)
NetR149_1: R149.1 U18.3(QD)
NetR150_1: R150.1 U18.4(QE)
NetR151_1: R151.1 U18.5(QF)
NetR152_1: R152.1 U18.6(QG)
NetR153_1: R153.1 U18.7(QH)
NetR154_1: R154.1 U19.15(QA)
NetR155_1: R155.1 U19.1(QB)
NetR156_1: R156.1 U19.2(QC)
NetR158_1: R158.1 U19.3(QD)
NetR159_1: R159.1 U19.4(QE)
NetR160_1: R160.1 U19.5(QF)
NetR162_1: R162.1 U19.6(QG)
NetR163_1: R163.1 U19.7(QH)
NetR164_1: R164.1 U20.15(QA)
NetR165_1: R165.1 U20.1(QB)
NetR166_1: R166.1 U20.2(QC)
NetR168_1: R168.1 U20.3(QD)
NetR169_1: R169.1 U20.4(QE)
NetR170_1: R170.1 U20.5(QF)
NetR172_1: R172.1 U20.6(QG)
NetR173_1: R173.1 U20.7(QH)
NetR174_1: R174.1 U21.15(QA)
NetR175_1: R175.1 U21.1(QB)
NetR176_1: R176.1 U21.2(QC)
NetR178_1: R178.1 U21.3(QD)
NetR179_1: R179.1 U21.4(QE)
NetR180_1: R180.1 U21.5(QF)
NetR182_1: R182.1 U21.6(QG)
NetR183_1: R183.1 U21.7(QH)

Not connected (* = marked no-connect by the designer): U17 9(SDO); U18 9(SDO); U19 9(SDO); U20 9(SDO); U21 9(SDO)

### Notes on the sheet
- Title
- Size:
- Date:
- A3
- Number:
- Time:
- Revision:
- Sheet
- of
- File:

### Library data of the parts
C55-C64 = C1206: Ceramic Chip Capacitor - Standard; Published: 17-Jul-2002; LatestRevisionDate: 19-Mar-2004; LatestRevisionNote: Silkscreen size reduced.; DatasheetDocument: Mar-2001; PackageDocument: Mar-2001; PackageReference: 1206; Publisher: Altium Limited; Code_JEITA: 1206; Code_IPC: 3216 [1206]; ComponentLink1Description: Manufacturer Link; ComponentLink1URL: http://www.kemet.com/; ComponentLink2Description: Datasheet; ComponentLink2URL: http://www.kemet.com/kemet/web/homepage/kechome.nsf/vapubfilesname/F3102TA.pdf/$file/F3102TA.pdf
P7-P11 = Header 11: Header, 11-Pin; LatestRevisionDate: 17-Jul-2002; LatestRevisionNote: Re-released for DXP Platform.; Publisher: Altium Limited
Q1-Q3 = BC817: NPN General-purpose Transistor; Published: 17-Sep-2003; LatestRevisionDate: 12-Dec-2006; LatestRevisionNote: IPC-7351 Footprint Added.; DatasheetVersion: Jun-1999; PackageVersion: May-1999; PackageReference: SOT23; Publisher: Altium Limited; PackageDescription: 3-Pin SOT-23 Package 0.95 mm Pitch, 2.3 mm Lead Span; ComponentLink1Description: Manufacturer Link; ComponentLink1URL: http://www.semiconductors.philips.com/; ComponentLink2Description: Datasheet; ComponentLink2URL: http://www.semiconductors.philips.com/acrobat/datasheets/BC817_BC817W_BC337_5.pdf
R136-R183 = ERA3Y: as R112 on sheet SignalAndKeyController; Published: 17-Dec-2003; LatestRevisionDate: 19-Mar-2004; LatestRevisionNote: Silkscreen size reduced.; PackageDocument: Mar-2003; PackageReference: ERA-0603; Publisher: Altium Limited; Code_IPC: 1608 [0603]; ComponentLink1Description: Manufacturer Link; ComponentLink1URL: http://www.panasonic.com/industrial/components/resistive_products.htm; ComponentLink2Description: Datasheet; ComponentLink2URL: http://www.panasonic.com/industrial/components/pdf/AOA0000CE8.pdf
U17-U21 = MC74HC595AD: as U10 on sheet SignalAndKeyController; Published: 15-Apr-2002; LatestRevisionDate: 13-Apr-2006; LatestRevisionNote: IPC-7351 Footprint Added.; DatasheetVersion: Mar-2000; PackageVersion: Oct-1999; PackageReference: 751B-05; Publisher: Altium Limited; PackageDescription: 16-Pin Small Outline Integrated Circuit 1.27 mm Pitch; Code_JEDEC: MS-012-AC; Code_IPC: SOIC127P600-16; ComponentLink1Description: Manufacturer Link; ComponentLink1URL: http://www.onsemi.com/; ComponentLink2Description: Datasheet; ComponentLink2URL: http://www.onsemi.com/pub/Collateral/MC74HC595A-D.PDF

## Sheet SKC_ErrrorDisplay.SchDoc: SKC Error Display
size A4; Author: eldar6776@hotmail.com; DrawnBy: Eldar Dedić; Organization: PROVEN d.o.o.; Address1: Adema Buće 102; Address2: 71000 Sarajevo; Address3: Federacija BiH; Address4: Bosna i Hercegovina; DocumentNumber: DE211213; Revision: 001; SheetNumber: 14; SheetTotal: 15
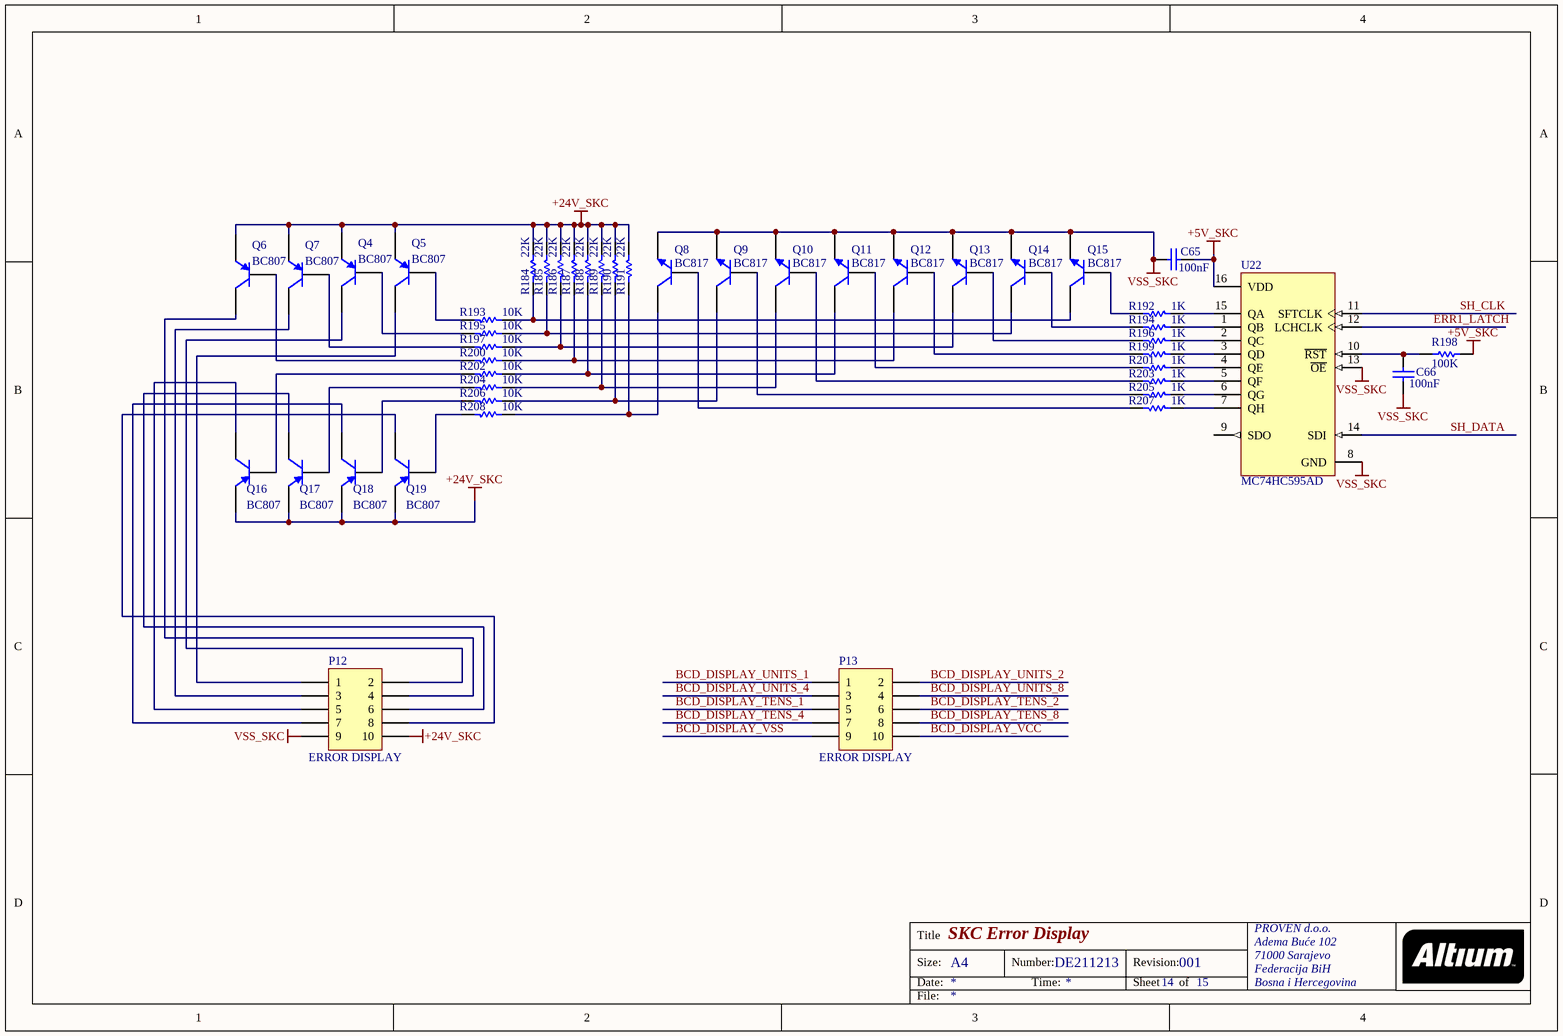
[diagram p4: SKC_ErrrorDisplay.SchDoc]

### Parts
C65  value 100nF  [1206]
C66  value 100nF  [1206]
P12  ERROR DISPLAY  [HDR2X5]
P13  ERROR DISPLAY  [HDR2X5]
Q4  BC807  [SOT23_N]
Q5  BC807  [SOT23_N]
Q6  BC807  [SOT23_N]
Q7  BC807  [SOT23_N]
Q8  BC817  [SOT23_N]
Q9  BC817  [SOT23_N]
Q10  BC817  [SOT23_N]
Q11  BC817  [SOT23_N]
Q12  BC817  [SOT23_N]
Q13  BC817  [SOT23_N]
Q14  BC817  [SOT23_N]
Q15  BC817  [SOT23_N]
Q16  BC807  [SOT23_N]
Q17  BC807  [SOT23_N]
Q18  BC807  [SOT23_N]
Q19  BC807  [SOT23_N]
R184  22K  [ERA-0805]
R185  22K  [ERA-0805]
R186  22K  [ERA-0805]
R187  22K  [ERA-0805]
R188  22K  [ERA-0805]
R189  22K  [ERA-0805]
R190  22K  [ERA-0805]
R191  22K  [ERA-0805]
R192  1K  [ERA-0805]
R193  10K  [ERA-0805]
R194  1K  [ERA-0805]
R195  10K  [ERA-0805]
R196  1K  [ERA-0805]
R197  10K  [ERA-0805]
R198  100K  [ERA-0603]
R199  1K  [ERA-0805]
R200  10K  [ERA-0805]
R201  1K  [ERA-0805]
R202  10K  [ERA-0805]
R203  1K  [ERA-0805]
R204  10K  [ERA-0805]
R205  1K  [ERA-0805]
R206  10K  [ERA-0805]
R207  1K  [ERA-0805]
R208  10K  [ERA-0805]
U22  MC74HC595AD  [751B-05_N]

### Nets
+5V_SKC: C65.2 R198.2 U22.16(VDD)
+24V_SKC: P12.10 Q4.2(E) Q5.2(E) Q6.2(E) Q7.2(E) Q16.2(E) Q17.2(E) Q18.2(E) Q19.2(E) R184.2 R185.2 R186.2 R187.2 R188.2 R189.2 R190.2 R191.2
VSS_SKC: C65.1 C66.1 P12.9 Q8.2(E) Q9.2(E) Q10.2(E) Q11.2(E) Q12.2(E) Q13.2(E) Q14.2(E) Q15.2(E) U22.8(GND) U22.13(~{OE})
BCD_DISPLAY_TENS_1: P13.5
BCD_DISPLAY_TENS_2: P13.6
BCD_DISPLAY_TENS_4: P13.7
BCD_DISPLAY_TENS_8: P13.8
BCD_DISPLAY_UNITS_1: P13.1
BCD_DISPLAY_UNITS_2: P13.2
BCD_DISPLAY_UNITS_4: P13.3
BCD_DISPLAY_UNITS_8: P13.4
BCD_DISPLAY_VCC: P13.10
BCD_DISPLAY_VSS: P13.9
ERR1_LATCH: U22.12(LCHCLK)
SH_CLK: U22.11(SFTCLK)
SH_DATA: U22.14(SDI)
NetC66_2: C66.2 R198.1 U22.10(~{RST})
NetP12_1: P12.1 Q5.3(C)
NetP12_2: P12.2 Q4.3(C)
NetP12_3: P12.3 Q7.3(C)
NetP12_4: P12.4 Q6.3(C)
NetP12_5: P12.5 Q16.3(C)
NetP12_6: P12.6 Q17.3(C)
NetP12_7: P12.7 Q18.3(C)
NetP12_8: P12.8 Q19.3(C)
NetQ4_1: Q4.1(B) R195.1
NetQ5_1: Q5.1(B) R193.1
NetQ6_1: Q6.1(B) R200.1
NetQ7_1: Q7.1(B) R197.1
NetQ8_1: Q8.1(B) R207.1
NetQ8_3: Q8.3(C) R191.1 R208.2
NetQ9_1: Q9.1(B) R205.1
NetQ9_3: Q9.3(C) R190.1 R206.2
NetQ10_1: Q10.1(B) R203.1
NetQ10_3: Q10.3(C) R189.1 R204.2
NetQ11_1: Q11.1(B) R201.1
NetQ11_3: Q11.3(C) R188.1 R202.2
NetQ12_1: Q12.1(B) R199.1
NetQ12_3: Q12.3(C) R187.1 R200.2
NetQ13_1: Q13.1(B) R196.1
NetQ13_3: Q13.3(C) R186.1 R197.2
NetQ14_1: Q14.1(B) R194.1
NetQ14_3: Q14.3(C) R185.1 R195.2
NetQ15_1: Q15.1(B) R192.1
NetQ15_3: Q15.3(C) R184.1 R193.2
NetQ16_1: Q16.1(B) R202.1
NetQ17_1: Q17.1(B) R204.1
NetQ18_1: Q18.1(B) R206.1
NetQ19_1: Q19.1(B) R208.1
NetR192_2: R192.2 U22.15(QA)
NetR194_2: R194.2 U22.1(QB)
NetR196_2: R196.2 U22.2(QC)
NetR199_2: R199.2 U22.3(QD)
NetR201_2: R201.2 U22.4(QE)
NetR203_2: R203.2 U22.5(QF)
NetR205_2: R205.2 U22.6(QG)
NetR207_2: R207.2 U22.7(QH)

Not connected (* = marked no-connect by the designer): U22 9(SDO)

### Notes on the sheet
- Title
- Size:
- Date:
- A4
- Number:
- Time:
- Revision:
- Sheet
- of
- File:

### Library data of the parts
C65 C66 = C1206: Ceramic Chip Capacitor - Standard; Published: 17-Jul-2002; LatestRevisionDate: 19-Mar-2004; LatestRevisionNote: Silkscreen size reduced.; DatasheetDocument: Mar-2001; PackageDocument: Mar-2001; PackageReference: 1206; Publisher: Altium Limited; Code_JEITA: 1206; Code_IPC: 3216 [1206]; ComponentLink1Description: Manufacturer Link; ComponentLink1URL: http://www.kemet.com/; ComponentLink2Description: Datasheet; ComponentLink2URL: http://www.kemet.com/kemet/web/homepage/kechome.nsf/vapubfilesname/F3102TA.pdf/$file/F3102TA.pdf
P12 P13 = Header 5X2: Header, 5-Pin, Dual row; LatestRevisionDate: 17-Jul-2002; LatestRevisionNote: Re-released for DXP Platform.; Publisher: Altium Limited
Q4-Q7 Q16-Q19 = BC807: PNP General-purpose Transistor; Published: 17-Sep-2003; LatestRevisionDate: 12-Dec-2006; LatestRevisionNote: IPC-7351 Footprint Added.; DatasheetVersion: 8-Apr-1999; PackageVersion: May-1999; PackageReference: SOT23; Publisher: Altium Limited; PackageDescription: 3-Pin SOT-23 Package 0.95 mm Pitch, 2.3 mm Lead Span; ComponentLink1Description: Manufacturer Link; ComponentLink1URL: http://www.semiconductors.philips.com/; ComponentLink2Description: Datasheet; ComponentLink2URL: http://www.semiconductors.philips.com/acrobat/datasheets/BC807_BC807W_BC327_5.pdf
Q8-Q15 = BC817-16: NPN General-purpose Transistor; Published: 17-Sep-2003; LatestRevisionDate: 12-Dec-2006; LatestRevisionNote: IPC-7351 Footprint Added.; DatasheetVersion: Jun-1999; PackageVersion: May-1999; PackageReference: SOT23; Publisher: Altium Limited; PackageDescription: 3-Pin SOT-23 Package 0.95 mm Pitch, 2.3 mm Lead Span; ComponentLink1Description: Manufacturer Link; ComponentLink1URL: http://www.semiconductors.philips.com/; ComponentLink2Description: Datasheet; ComponentLink2URL: http://www.semiconductors.philips.com/acrobat/datasheets/BC817_BC817W_BC337_5.pdf
R184-R197 R199-R208 = ERA6Y: as R1 on sheet SignalOutput; Published: 17-Dec-2003; LatestRevisionDate: 19-Mar-2004; LatestRevisionNote: Silkscreen size reduced.; PackageDocument: Mar-2003; PackageReference: ERA-0805; Publisher: Altium Limited; Code_IPC: 2012 [0805]; ComponentLink1Description: Manufacturer Link; ComponentLink1URL: http://www.panasonic.com/industrial/components/resistive_products.htm; ComponentLink2Description: Datasheet; ComponentLink2URL: http://www.panasonic.com/industrial/components/pdf/AOA0000CE8.pdf
R198 = ERA3Y: as R112 on sheet SignalAndKeyController; Published: 17-Dec-2003; LatestRevisionDate: 19-Mar-2004; LatestRevisionNote: Silkscreen size reduced.; PackageDocument: Mar-2003; PackageReference: ERA-0603; Publisher: Altium Limited; Code_IPC: 1608 [0603]; ComponentLink1Description: Manufacturer Link; ComponentLink1URL: http://www.panasonic.com/industrial/components/resistive_products.htm; ComponentLink2Description: Datasheet; ComponentLink2URL: http://www.panasonic.com/industrial/components/pdf/AOA0000CE8.pdf
U22 = MC74HC595AD: as U10 on sheet SignalAndKeyController; Published: 15-Apr-2002; LatestRevisionDate: 13-Apr-2006; LatestRevisionNote: IPC-7351 Footprint Added.; DatasheetVersion: Mar-2000; PackageVersion: Oct-1999; PackageReference: 751B-05; Publisher: Altium Limited; PackageDescription: 16-Pin Small Outline Integrated Circuit 1.27 mm Pitch; Code_JEDEC: MS-012-AC; Code_IPC: SOIC127P600-16; ComponentLink1Description: Manufacturer Link; ComponentLink1URL: http://www.onsemi.com/; ComponentLink2Description: Datasheet; ComponentLink2URL: http://www.onsemi.com/pub/Collateral/MC74HC595A-D.PDF

## Sheet KeyInput.SchDoc: Key Input
size A3; Author: eldar6776@hotmail.com; DrawnBy: Eldar Dedić; Organization: PROVEN d.o.o.; Address1: Adema Buće 102; Address2: 71000 Sarajevo; Address3: Federacija BiH; Address4: Bosna i Hercegovina; DocumentNumber: DE211213; Revision: 001; SheetNumber: 12; SheetTotal: 15; ProjectName: MIKSER SIROVINE
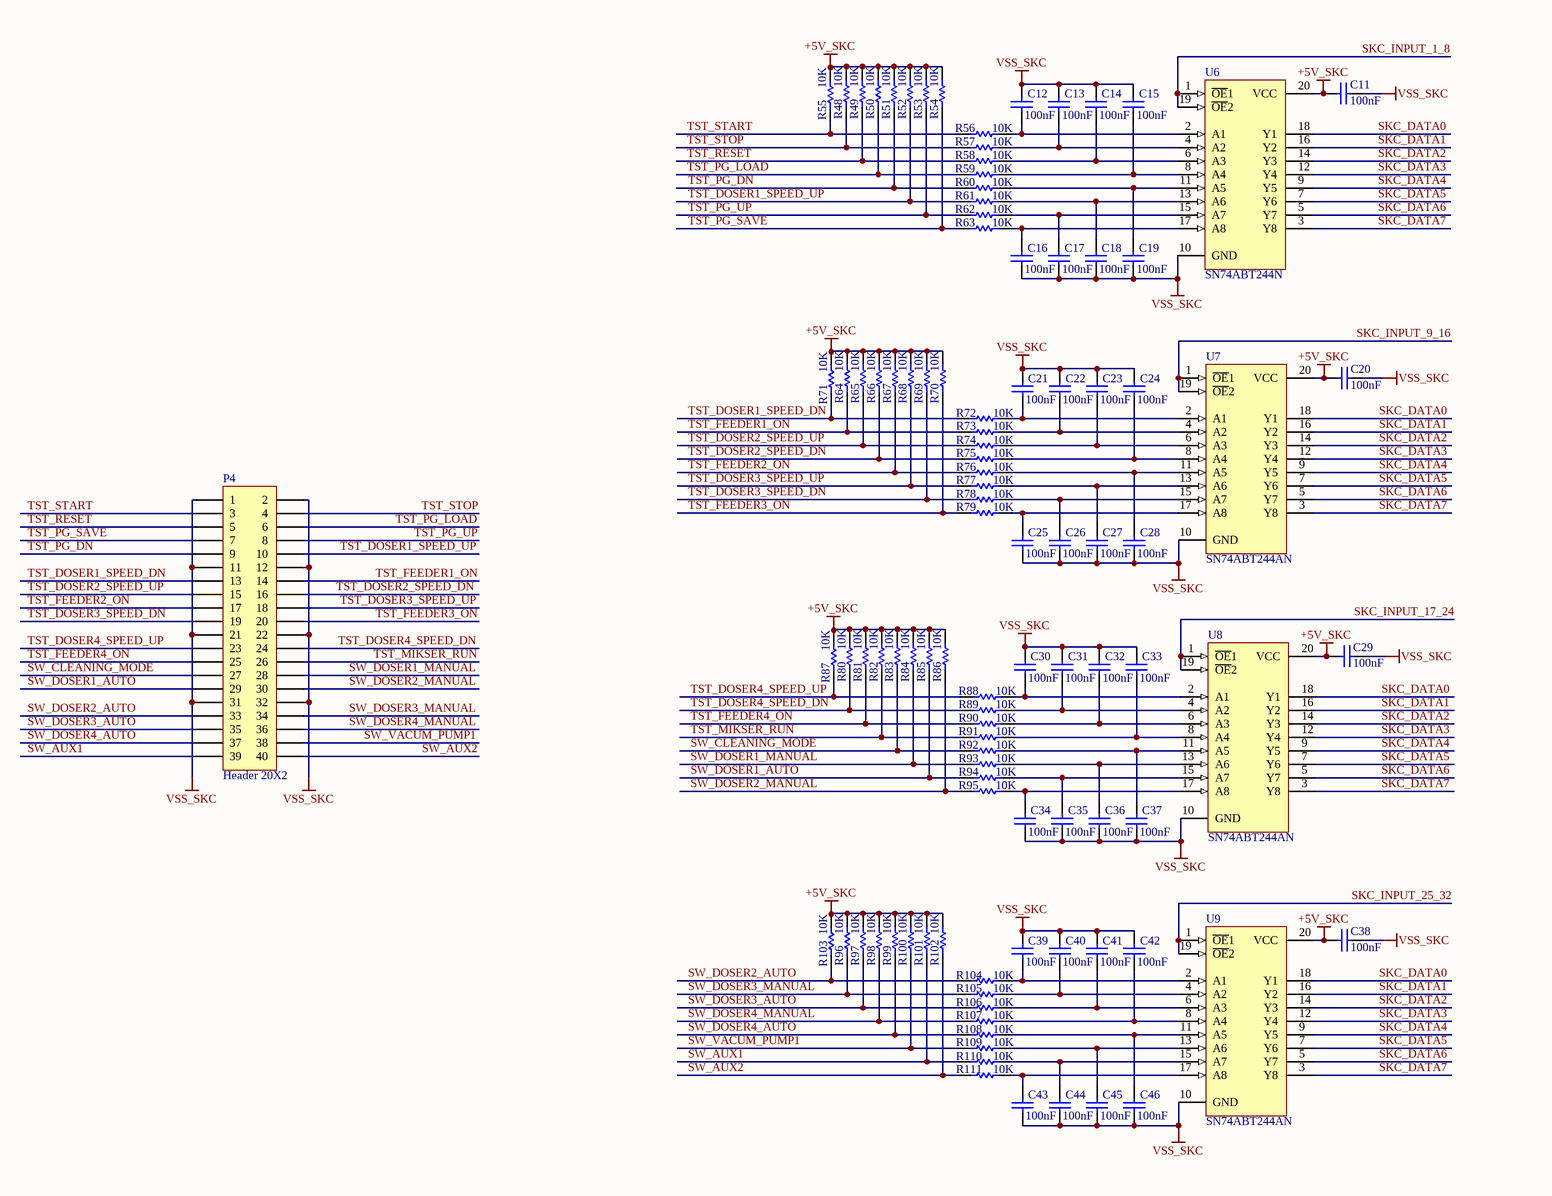
[diagram p5: KeyInput.SchDoc]

### Parts
C11  value 100nF  [1206]
C12  value 100nF  [1206]
C13  value 100nF  [1206]
C14  value 100nF  [1206]
C15  value 100nF  [1206]
C16  value 100nF  [1206]
C17  value 100nF  [1206]
C18  value 100nF  [1206]
C19  value 100nF  [1206]
C20  value 100nF  [1206]
C21  value 100nF  [1206]
C22  value 100nF  [1206]
C23  value 100nF  [1206]
C24  value 100nF  [1206]
C25  value 100nF  [1206]
C26  value 100nF  [1206]
C27  value 100nF  [1206]
C28  value 100nF  [1206]
C29  value 100nF  [1206]
C30  value 100nF  [1206]
C31  value 100nF  [1206]
C32  value 100nF  [1206]
C33  value 100nF  [1206]
C34  value 100nF  [1206]
C35  value 100nF  [1206]
C36  value 100nF  [1206]
C37  value 100nF  [1206]
C38  value 100nF  [1206]
C39  value 100nF  [1206]
C40  value 100nF  [1206]
C41  value 100nF  [1206]
C42  value 100nF  [1206]
C43  value 100nF  [1206]
C44  value 100nF  [1206]
C45  value 100nF  [1206]
C46  value 100nF  [1206]
P4  Header 20X2  [HDR2X20]
R48  10K  [ERA-0805]
R49  10K  [ERA-0805]
R50  10K  [ERA-0805]
R51  10K  [ERA-0805]
R52  10K  [ERA-0805]
R53  10K  [ERA-0805]
R54  10K  [ERA-0805]
R55  10K  [ERA-0805]
R56  10K  [ERA-0805]
R57  10K  [ERA-0805]
R58  10K  [ERA-0805]
R59  10K  [ERA-0805]
R60  10K  [ERA-0805]
R61  10K  [ERA-0805]
R62  10K  [ERA-0805]
R63  10K  [ERA-0805]
R64  10K  [ERA-0805]
R65  10K  [ERA-0805]
R66  10K  [ERA-0805]
R67  10K  [ERA-0805]
R68  10K  [ERA-0805]
R69  10K  [ERA-0805]
R70  10K  [ERA-0805]
R71  10K  [ERA-0805]
R72  10K  [ERA-0805]
R73  10K  [ERA-0805]
R74  10K  [ERA-0805]
R75  10K  [ERA-0805]
R76  10K  [ERA-0805]
R77  10K  [ERA-0805]
R78  10K  [ERA-0805]
R79  10K  [ERA-0805]
R80  10K  [ERA-0805]
R81  10K  [ERA-0805]
R82  10K  [ERA-0805]
R83  10K  [ERA-0805]
R84  10K  [ERA-0805]
R85  10K  [ERA-0805]
R86  10K  [ERA-0805]
R87  10K  [ERA-0805]
R88  10K  [ERA-0805]
R89  10K  [ERA-0805]
R90  10K  [ERA-0805]
R91  10K  [ERA-0805]
R92  10K  [ERA-0805]
R93  10K  [ERA-0805]
R94  10K  [ERA-0805]
R95  10K  [ERA-0805]
R96  10K  [ERA-0805]
R97  10K  [ERA-0805]
R98  10K  [ERA-0805]
R99  10K  [ERA-0805]
R100  10K  [ERA-0805]
R101  10K  [ERA-0805]
R102  10K  [ERA-0805]
R103  10K  [ERA-0805]
R104  10K  [ERA-0805]
R105  10K  [ERA-0805]
R106  10K  [ERA-0805]
R107  10K  [ERA-0805]
R108  10K  [ERA-0805]
R109  10K  [ERA-0805]
R110  10K  [ERA-0805]
R111  10K  [ERA-0805]
U6  SN74ABT244N  [N020]
U7  SN74ABT244AN  [N020]
U8  SN74ABT244AN  [N020]
U9  SN74ABT244AN  [N020]

### Nets
+5V_SKC: C11.1 C20.1 C29.1 C38.1 R48.2 R49.2 R50.2 R51.2 R52.2 R53.2 R54.2 R55.2 R64.2 R65.2 R66.2 R67.2 R68.2 R69.2 R70.2 R71.2 R80.2 R81.2 R82.2 R83.2 R84.2 R85.2 R86.2 R87.2 R96.2 R97.2 R98.2 R99.2 R100.2 R101.2 R102.2 R103.2 U6.20(VCC) U7.20(VCC) U8.20(VCC) U9.20(VCC)
VSS_SKC: C11.2 C12.2 C13.2 C14.2 C15.2 C16.1 C17.1 C18.1 C19.1 C20.2 C21.2 C22.2 C23.2 C24.2 C25.1 C26.1 C27.1 C28.1 C29.2 C30.2 C31.2 C32.2 C33.2 C34.1 C35.1 C36.1 C37.1 C38.2 C39.2 C40.2 C41.2 C42.2 C43.1 C44.1 C45.1 C46.1 P4.1 P4.2 P4.11 P4.12 P4.21 P4.22 P4.31 P4.32 U6.10(GND) U7.10(GND) U8.10(GND) U9.10(GND)
SKC_DATA0: U6.18(Y1) U7.18(Y1) U8.18(Y1) U9.18(Y1)
SKC_DATA1: U6.16(Y2) U7.16(Y2) U8.16(Y2) U9.16(Y2)
SKC_DATA2: U6.14(Y3) U7.14(Y3) U8.14(Y3) U9.14(Y3)
SKC_DATA3: U6.12(Y4) U7.12(Y4) U8.12(Y4) U9.12(Y4)
SKC_DATA4: U6.9(Y5) U7.9(Y5) U8.9(Y5) U9.9(Y5)
SKC_DATA5: U6.7(Y6) U7.7(Y6) U8.7(Y6) U9.7(Y6)
SKC_DATA6: U6.5(Y7) U7.5(Y7) U8.5(Y7) U9.5(Y7)
SKC_DATA7: U6.3(Y8) U7.3(Y8) U8.3(Y8) U9.3(Y8)
SKC_INPUT_1_8: U6.1(~{OE}1) U6.19(~{OE}2)
SKC_INPUT_9_16: U7.1(~{OE}1) U7.19(~{OE}2)
SKC_INPUT_17_24: U8.1(~{OE}1) U8.19(~{OE}2)
SKC_INPUT_25_32: U9.1(~{OE}1) U9.19(~{OE}2)
SW_AUX1: P4.39 R101.1 R110.1
SW_AUX2: P4.40 R102.1 R111.1
SW_CLEANING_MODE: P4.27 R83.1 R92.1
SW_DOSER1_AUTO: P4.29 R85.1 R94.1
SW_DOSER1_MANUAL: P4.28 R84.1 R93.1
SW_DOSER2_AUTO: P4.33 R103.1 R104.1
SW_DOSER2_MANUAL: P4.30 R86.1 R95.1
SW_DOSER3_AUTO: P4.35 R97.1 R106.1
SW_DOSER3_MANUAL: P4.34 R96.1 R105.1
SW_DOSER4_AUTO: P4.37 R99.1 R108.1
SW_DOSER4_MANUAL: P4.36 R98.1 R107.1
SW_VACUM_PUMP1: P4.38 R100.1 R109.1
TST_DOSER1_SPEED_DN: P4.13 R71.1 R72.1
TST_DOSER1_SPEED_UP: P4.10 R52.1 R61.1
TST_DOSER2_SPEED_DN: P4.16 R66.1 R75.1
TST_DOSER2_SPEED_UP: P4.15 R65.1 R74.1
TST_DOSER3_SPEED_DN: P4.19 R69.1 R78.1
TST_DOSER3_SPEED_UP: P4.18 R68.1 R77.1
TST_DOSER4_SPEED_DN: P4.24 R80.1 R89.1
TST_DOSER4_SPEED_UP: P4.23 R87.1 R88.1
TST_FEEDER1_ON: P4.14 R64.1 R73.1
TST_FEEDER2_ON: P4.17 R67.1 R76.1
TST_FEEDER3_ON: P4.20 R70.1 R79.1
TST_FEEDER4_ON: P4.25 R81.1 R90.1
TST_MIKSER_RUN: P4.26 R82.1 R91.1
TST_PG_DN: P4.9 R51.1 R60.1
TST_PG_LOAD: P4.6 R50.1 R59.1
TST_PG_SAVE: P4.7 R54.1 R63.1
TST_PG_UP: P4.8 R53.1 R62.1
TST_RESET: P4.5 R49.1 R58.1
TST_START: P4.3 R55.1 R56.1
TST_STOP: P4.4 R48.1 R57.1
NetC12_1: C12.1 R56.2 U6.2(A1)
NetC13_1: C13.1 R57.2 U6.4(A2)
NetC14_1: C14.1 R58.2 U6.6(A3)
NetC15_1: C15.1 R59.2 U6.8(A4)
NetC16_2: C16.2 R63.2 U6.17(A8)
NetC17_2: C17.2 R62.2 U6.15(A7)
NetC18_2: C18.2 R61.2 U6.13(A6)
NetC19_2: C19.2 R60.2 U6.11(A5)
NetC21_1: C21.1 R72.2 U7.2(A1)
NetC22_1: C22.1 R73.2 U7.4(A2)
NetC23_1: C23.1 R74.2 U7.6(A3)
NetC24_1: C24.1 R75.2 U7.8(A4)
NetC25_2: C25.2 R79.2 U7.17(A8)
NetC26_2: C26.2 R78.2 U7.15(A7)
NetC27_2: C27.2 R77.2 U7.13(A6)
NetC28_2: C28.2 R76.2 U7.11(A5)
NetC30_1: C30.1 R88.2 U8.2(A1)
NetC31_1: C31.1 R89.2 U8.4(A2)
NetC32_1: C32.1 R90.2 U8.6(A3)
NetC33_1: C33.1 R91.2 U8.8(A4)
NetC34_2: C34.2 R95.2 U8.17(A8)
NetC35_2: C35.2 R94.2 U8.15(A7)
NetC36_2: C36.2 R93.2 U8.13(A6)
NetC37_2: C37.2 R92.2 U8.11(A5)
NetC39_1: C39.1 R104.2 U9.2(A1)
NetC40_1: C40.1 R105.2 U9.4(A2)
NetC41_1: C41.1 R106.2 U9.6(A3)
NetC42_1: C42.1 R107.2 U9.8(A4)
NetC43_2: C43.2 R111.2 U9.17(A8)
NetC44_2: C44.2 R110.2 U9.15(A7)
NetC45_2: C45.2 R109.2 U9.13(A6)
NetC46_2: C46.2 R108.2 U9.11(A5)

### Notes on the sheet
- Title
- Size:
- Date:
- A3
- Number:
- Time:
- Revision:
- Sheet
- of
- File:

### Library data of the parts
C11-C46 = C1206: Ceramic Chip Capacitor - Standard; Published: 17-Jul-2002; LatestRevisionDate: 19-Mar-2004; LatestRevisionNote: Silkscreen size reduced.; DatasheetDocument: Mar-2001; PackageDocument: Mar-2001; PackageReference: 1206; Publisher: Altium Limited; Code_JEITA: 1206; Code_IPC: 3216 [1206]; ComponentLink1Description: Manufacturer Link; ComponentLink1URL: http://www.kemet.com/; ComponentLink2Description: Datasheet; ComponentLink2URL: http://www.kemet.com/kemet/web/homepage/kechome.nsf/vapubfilesname/F3102TA.pdf/$file/F3102TA.pdf
P4 = Header 20X2: Header, 20-Pin, Dual row; LatestRevisionDate: 17-Jul-2002; LatestRevisionNote: Re-released for DXP Platform.; Publisher: Altium Limited
R48-R111 = ERA6Y: as R1 on sheet SignalOutput; Published: 17-Dec-2003; LatestRevisionDate: 19-Mar-2004; LatestRevisionNote: Silkscreen size reduced.; PackageDocument: Mar-2003; PackageReference: ERA-0805; Publisher: Altium Limited; Code_IPC: 2012 [0805]; ComponentLink1Description: Manufacturer Link; ComponentLink1URL: http://www.panasonic.com/industrial/components/resistive_products.htm; ComponentLink2Description: Datasheet; ComponentLink2URL: http://www.panasonic.com/industrial/components/pdf/AOA0000CE8.pdf
U6 = SN74ABT244N: Octal Buffer/Driver with 3-State Outputs; ComponentAvailability: Obsolete; Published: 8-Jun-2000; LatestRevisionDate: 06-Jun-2005; LatestRevisionNote: Stylized 3D Model Added.; DatasheetVersion: Jul-1994; PackageVersion: Oct-1995; PackageReference: N020; Publisher: Altium Limited; PackageDescription: DIP; 20 Leads; Row Spacing 7.62 mm; Pitch 2.54 mm; ComponentLink1Description: Manufacturer Link; ComponentLink1URL: http://www.ti.com/; ComponentLink2Description: Discontinuation Notice; ComponentLink2URL: http://focus.ti.com/docs/prod/folders/print/sn74abt244.html
U7-U9 = SN74ABT244AN: Octal Buffer/Driver with 3-State Outputs; Published: 8-Jun-2000; LatestRevisionDate: 06-Jun-2005; LatestRevisionNote: Stylized 3D Model Added.; DatasheetVersion: Jan-1997; PackageVersion: Oct-1995; PackageReference: N020; Publisher: Altium Limited; PackageDescription: DIP; 20 Leads; Row Spacing 7.62 mm; Pitch 2.54 mm; ComponentLink1Description: Manufacturer Link; ComponentLink1URL: http://www.ti.com/; ComponentLink2Description: Datasheet; ComponentLink2URL: http://www-s.ti.com/sc/ds/sn74abt244a.pdf